# EAGLE design SenseLora 4G LTE CAT1 Gateway V1.2 (EAGLE 6.1)
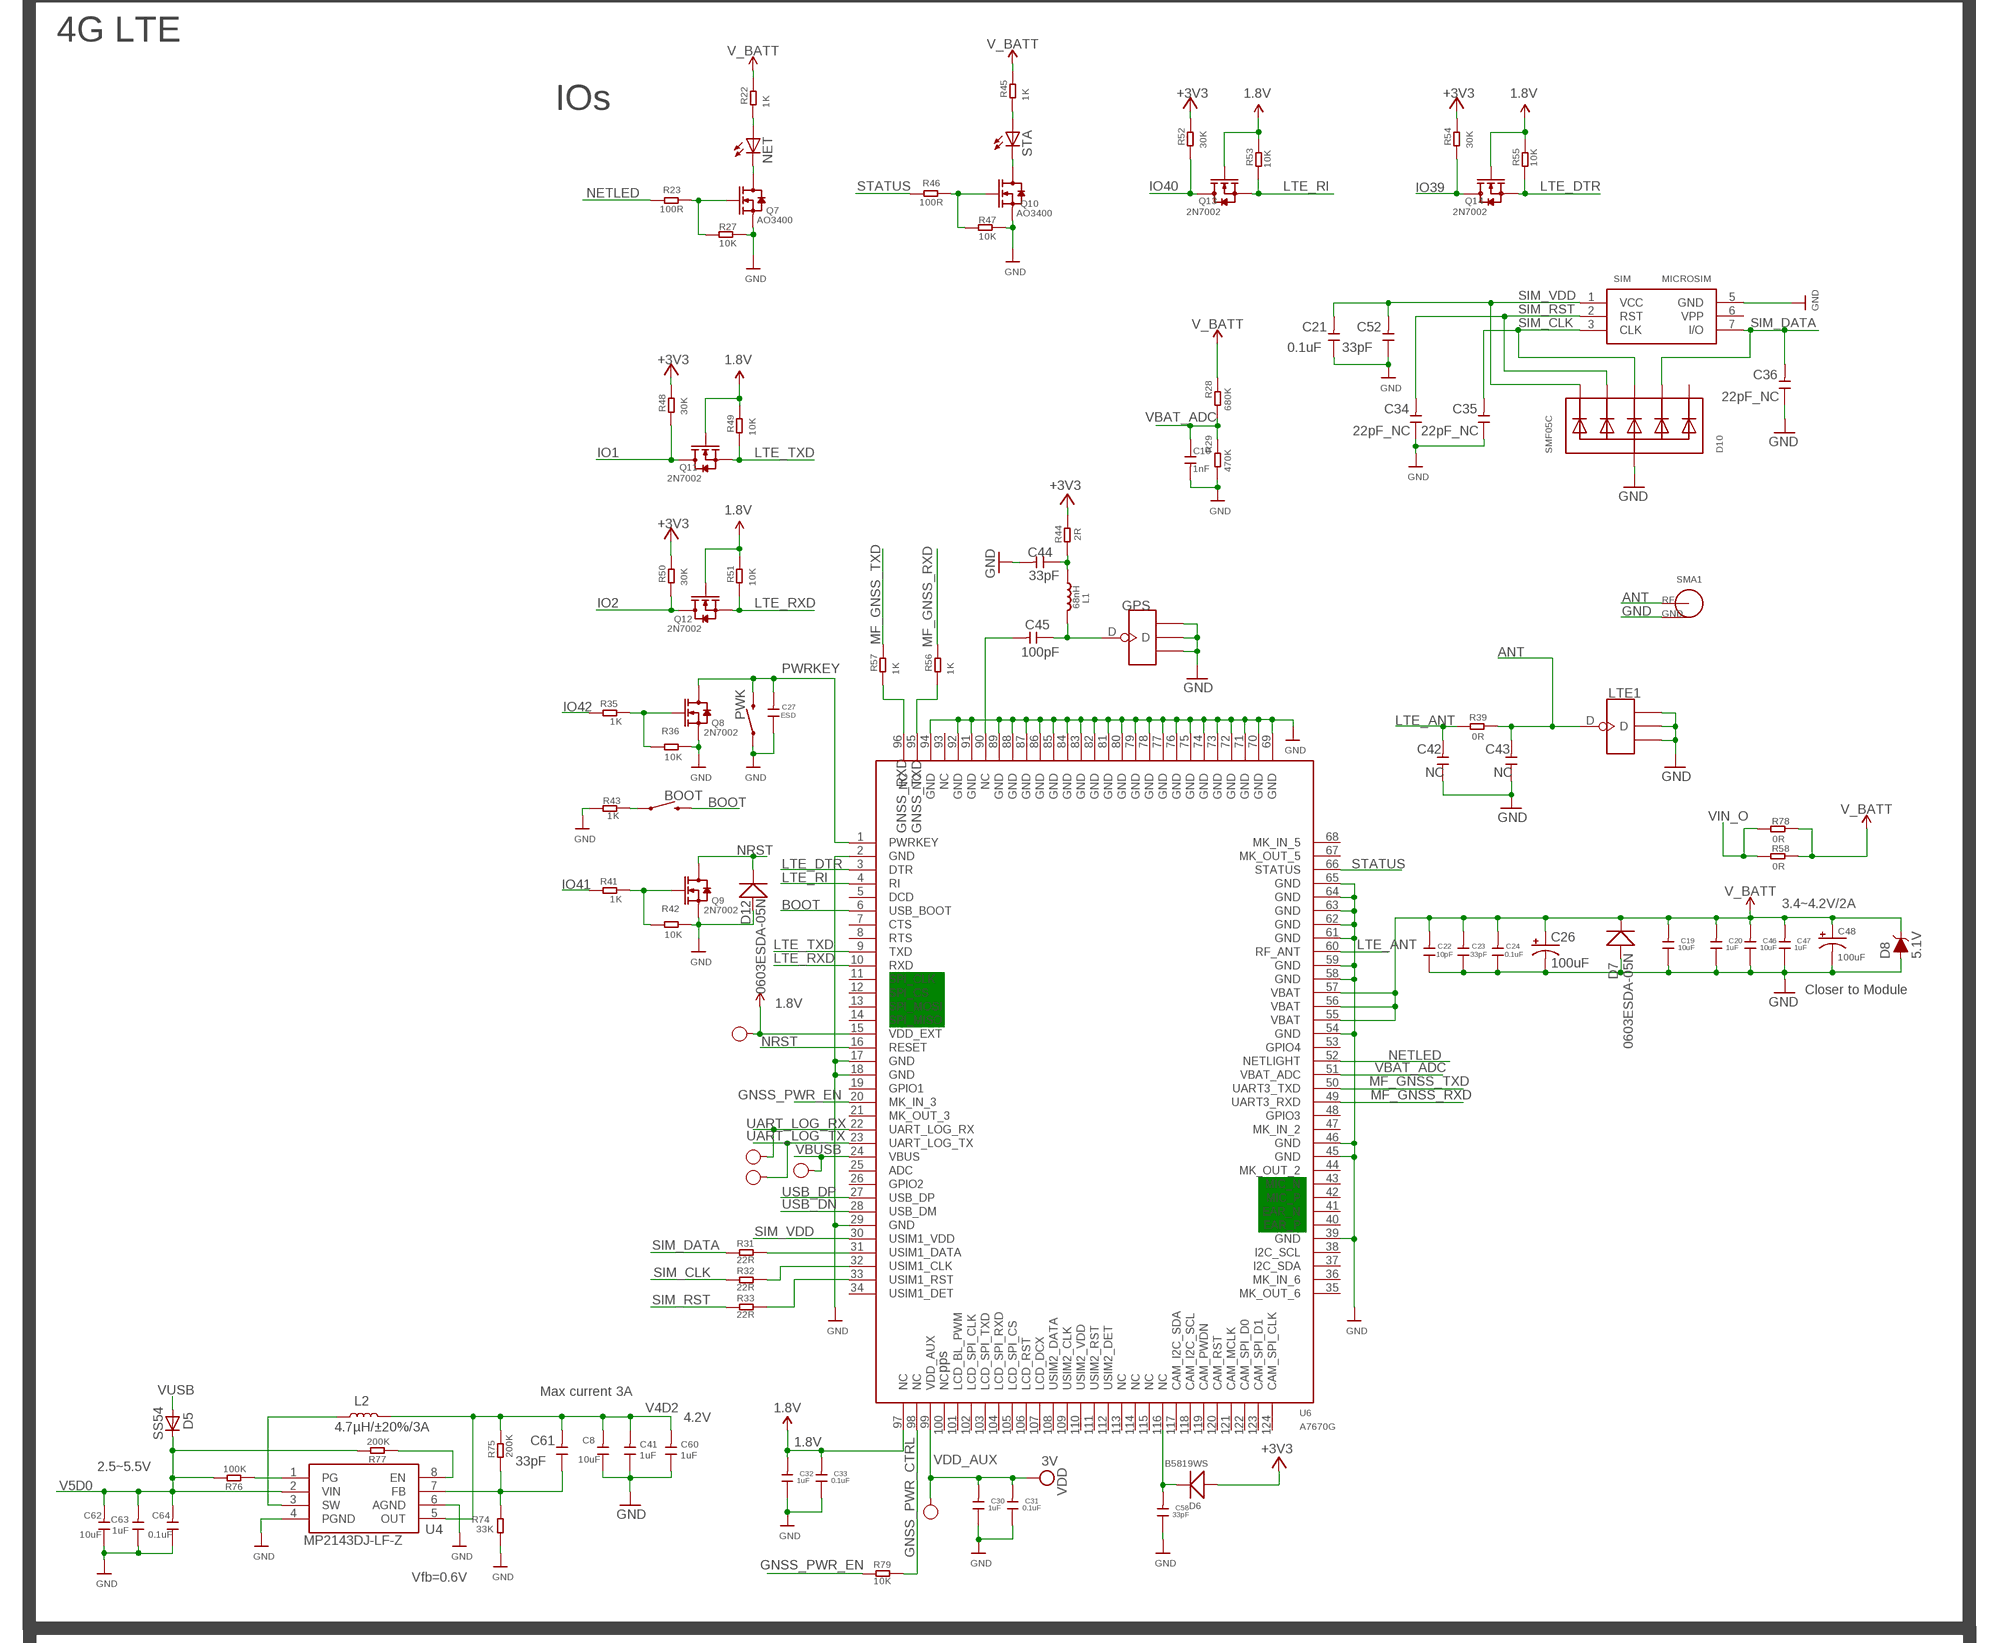
[diagram p0: schematic, sheet 1, part 1 of 2]
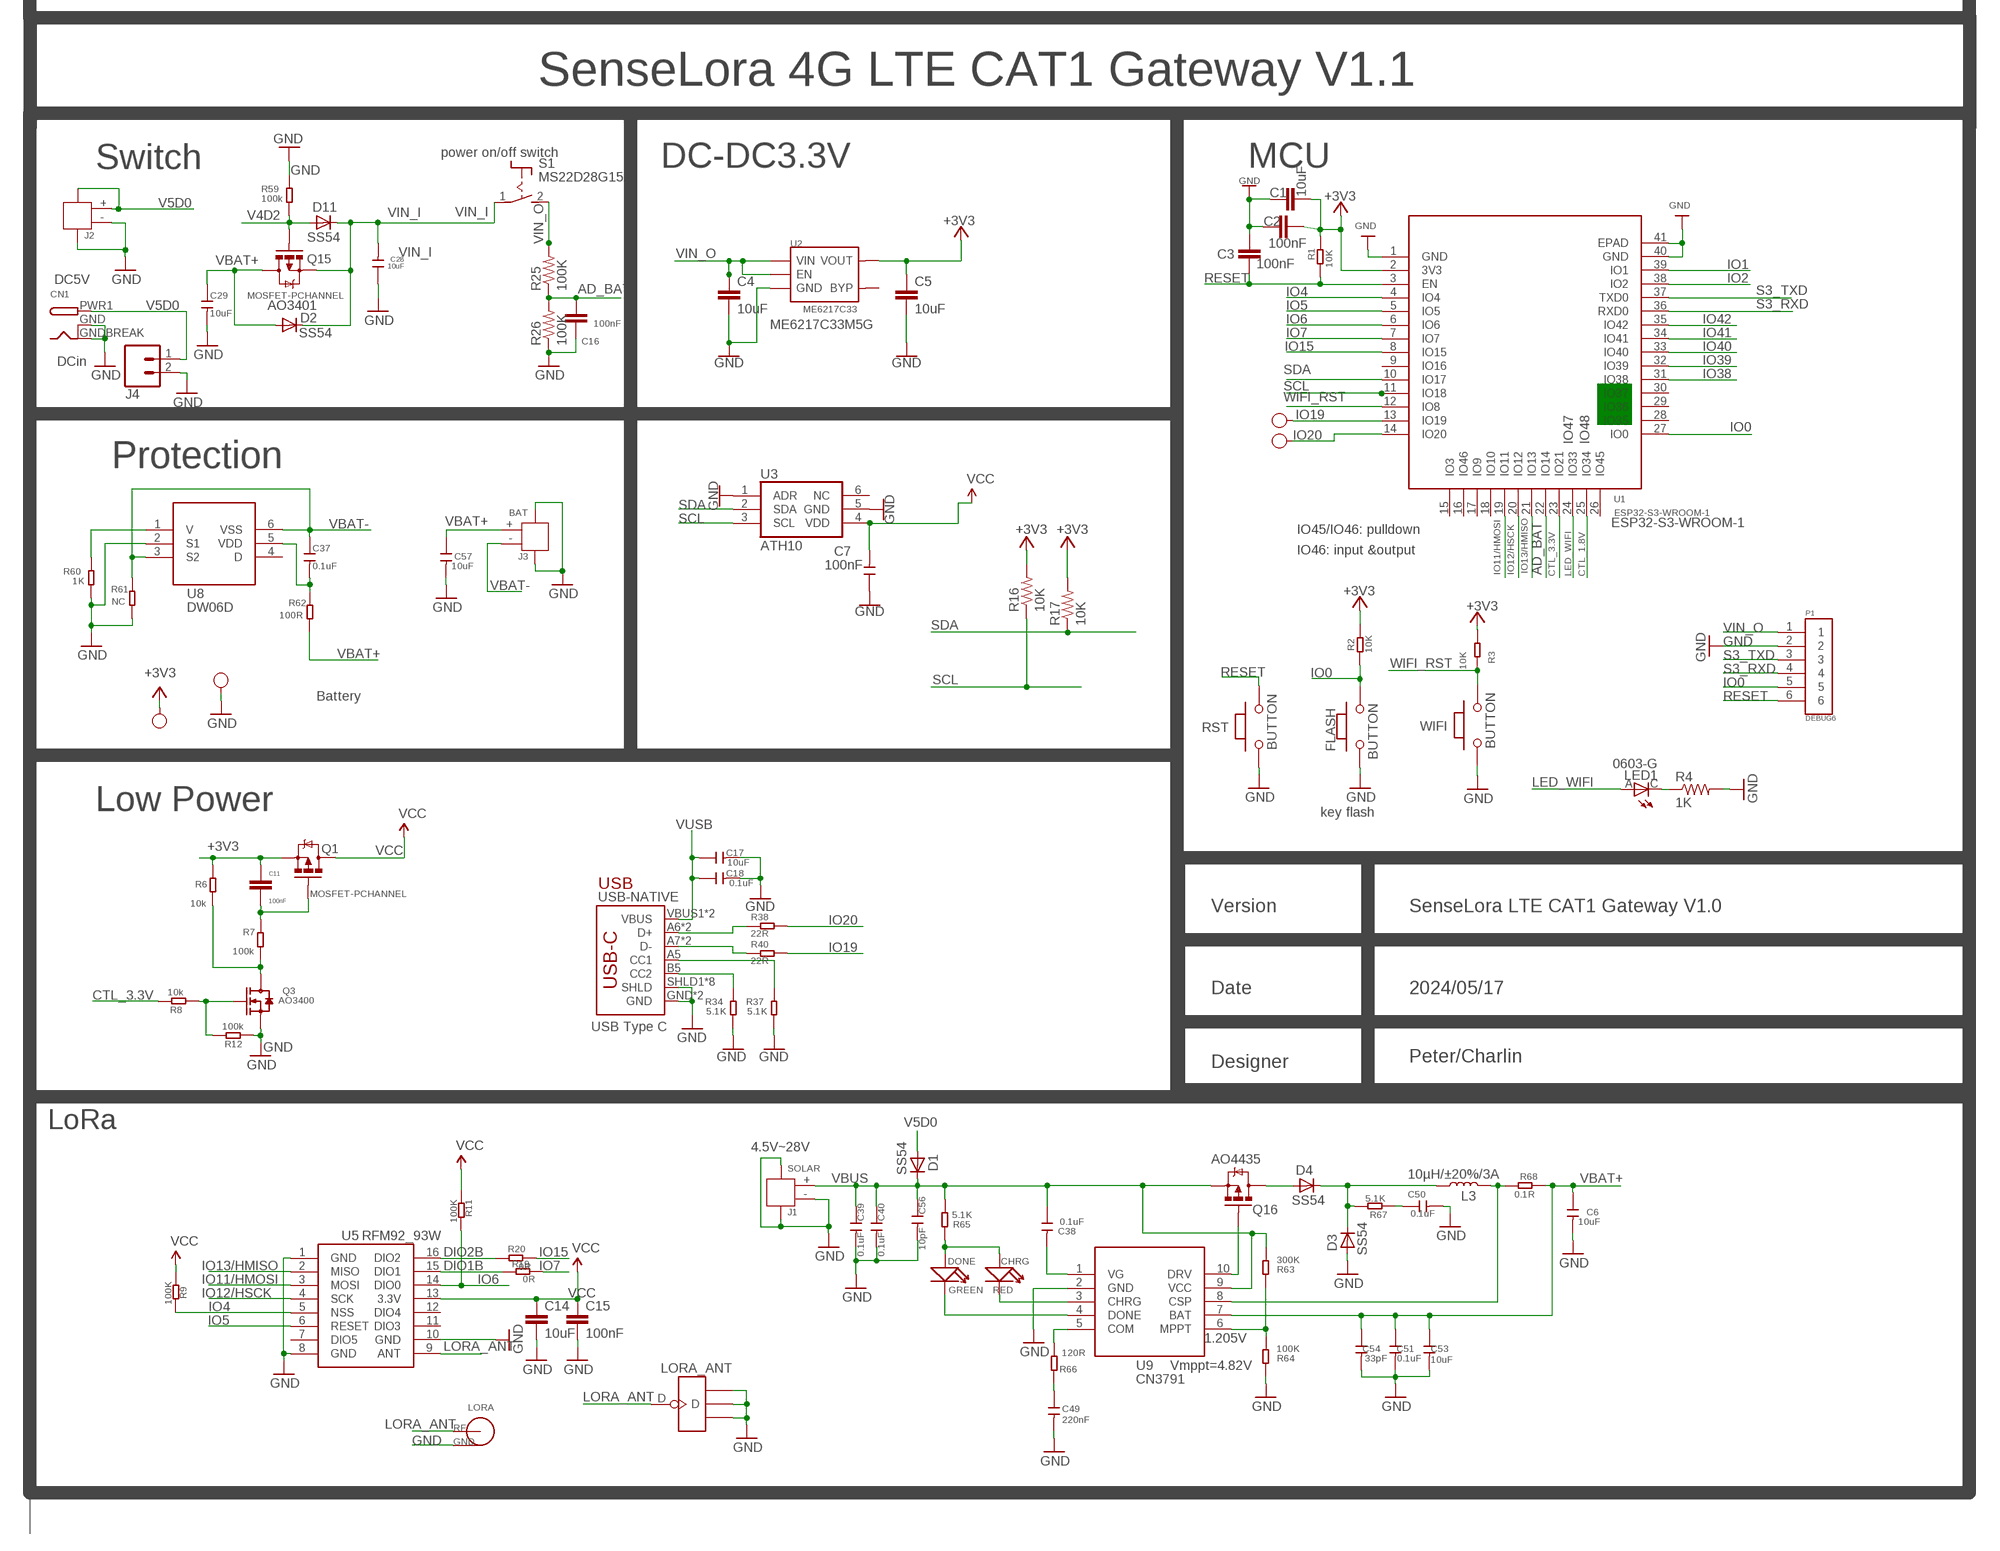
[diagram p1: schematic, sheet 1, part 2 of 2]

## Parts
1V8  TEST-POINT'4545'  [TP-D45MIL]
3V  TEST-POINT'4545'  [TP-D45MIL]
3V1  TEST-POINT'4545'  [TP-D45MIL]
3V2  TEST-POINT'4545'  [TP-D45MIL]
3V3  TEST-POINT'4545'  [TP-D45MIL]
BOOT  MOMENTARY-SWITCH-SPST-SMD-6.0X3.5MM  [TACTILE_SWITCH_SMD_6.0X3.5MM]
C1  10uF  C0603  [C0603]
C2  100nF  C0603  [C0603]
C3  100nF  C0603  [C0603]
C4  10uF  C0603  [C0603]
C5  10uF  C0603  [C0603]
C6  10uF  DISCRETE_C-0603  [DISCRETE_C0603]
C7  100nF  C-0603  [0603]
C8  10uF  C-0603  [0603]
C10  1nF  C-0603  [0603]
C11  100nF  C0603  [C0603]
C14  10uF  C0603  [C0603]
C15  100nF  C0603  [C0603]
C16  100nF  C0603  [C0603]
C17  10uF  C-0603  [0603]
C18  0.1uF  C-0603  [0603]
C19  10uF  C-0603  [0603]
C20  1uF  C-0603  [0603]
C21  0.1uF  C-0603  [0603]
C22  10pF  C-0603  [0603]
C23  33pF  C-0603  [0603]
C24  0.1uF  C-0603  [0603]
C26  100uF  68UF-POLAR-EIA3528-10V-10%(TANT)  [EIA3528]
C27  ESD  C-0603  [0603]
C28  10uF  C-0603  [0603]
C29  10uF  C-0603  [0603]
C30  1uF  C-0603  [0603]
C31  0.1uF  C-0603  [0603]
C32  1uF  C-0603  [0603]
C33  0.1uF  C-0603  [0603]
C34  22pF_NC  C-0603  [0603]
C35  22pF_NC  C-0603  [0603]
C36  22pF_NC  C-0603  [0603]
C37  0.1uF  C-0603  [0603]
C38  0.1uF  DISCRETE_C-0603  [DISCRETE_C0603]
C39  0.1uF  DISCRETE_C-0603  [DISCRETE_C0603]
C40  0.1uF  DISCRETE_C-0603  [DISCRETE_C0603]
C41  1uF  C-0603  [0603]
C42  NC  C-0603  [0603]
C43  NC  C-0603  [0603]
C44  33pF  C-0603  [0603]
C45  100pF  C-0603  [0603]
C46  10uF  C-0603  [0603]
C47  1uF  C-0603  [0603]
C48  100uF  68UF-POLAR-EIA3528-10V-10%(TANT)  [EIA3528]
C49  220nF  DISCRETE_C-0603  [DISCRETE_C0603]
C50  0.1uF  DISCRETE_C-0603  [DISCRETE_C0603]
C51  0.1uF  DISCRETE_C-0603  [DISCRETE_C0603]
C52  33pF  C-0603  [0603]
C53  10uF  DISCRETE_C-0603  [DISCRETE_C0603]
C54  33pF  DISCRETE_C-0603  [DISCRETE_C0603]
C56  10pF  DISCRETE_C-0603  [DISCRETE_C0603]
C57  10uF  DISCRETE_C-0603  [DISCRETE_C0603]
C58  33pF  C-0603  [0603]
C60  1uF  C-0603  [0603]
C61  33pF  C-0603  [0603]
C62  10uF  C-0603  [0603]
C63  1uF  C-0603  [0603]
C64  0.1uF  C-0603  [0603]
CHRG  RED  LED'0603'  [LED-0603]
CN1  DCBARRELSMT  [DCJACK_2MM_SMT]
D1  SS54  DIODE-DO-214AC  [DO-214AC]
D2  SS54  DIODE-DO-214AC  [DO-214AC]
D3  SS54  DIODE-DO-214AC  [DO-214AC]
D4  SS54  DIODE-DO-214AC  [DO-214AC]
D5  SS54  DIODE-DO-214AC  [DO-214AC]
D6  B5819WS  D'0805'  [SOD323]
D7  0603ESDA-05N  DISCRETE_D0603  [DISCRETE_SOD523]
D8  5.1V  DIODE-ZENER-MMSZ5232BS  [SOD-323]
D10  SMF05C  TVSARRAY_5LANE  [SOT363]
D11  SS54  DIODE-DO-214AC  [DO-214AC]
D12  0603ESDA-05N  DISCRETE_D0603  [DISCRETE_SOD523]
DONE  GREEN  LED'0603'  [LED-0603]
FLASH  BUTTON  PB157  [157SW]
GND  TEST-POINT'4545'  [TP-D45MIL]
GPS  ANTENNA-U-FL  [4P-U-FL]
J1  SOLAR  JST-2P-SMD'2.0'  [HW2-SMD-2.0-90D]
J2  DC  JST-2P-SMD'2.0'  [HW2-SMD-2.0-90D]
J3  BAT  JST-2P-SMD'2.0'  [HW2-SMD-2.0-90D]
J4  CONN_02PTH4  [1X02_XTRA_BIG]
L1  68nH  L'0603'  [L0603]
L2  4.7µH/±20%/3A  INDUCTOR-SRN6045-33UH  [SRN6045]
L3  10µH/±20%/3A  INDUCTOR-SRN6045-33UH  [SRN6045]
LED1  0603-G  LED0603  [LED0603]
LORA  SMA-KWE  [SMA-KWE]
LORA_ANT  ANTENNA-U-FL  [4P-U-FL]
LTE1  ANTENNA-U-FL  [4P-U-FL]
NET  NET  LEDCHIP-LED0805  [CHIP-LED0805]
P1  DEBUG6  [DEBUG*6]
PWK  MOMENTARY-SWITCH-SPST-SMD-6.0X3.5MM  [TACTILE_SWITCH_SMD_6.0X3.5MM]
Q1  MOSFET-PCHANNEL  [SOT23-3]
Q3  AO3400  MOSFET-N'SOT23'  [SOT23]
Q7  AO3400  MOSFET-N'SOT23'  [SOT23]
Q8  2N7002  MOSFET-N'SOT23'  [SOT23]
Q9  2N7002  MOSFET-N'SOT23'  [SOT23]
Q10  AO3400  MOSFET-N'SOT23'  [SOT23]
Q11  2N7002  MOSFET-N'SOT23'  [SOT23]
Q12  2N7002  MOSFET-N'SOT23'  [SOT23]
Q13  2N7002  MOSFET-N'SOT23'  [SOT23]
Q14  2N7002  MOSFET-N'SOT23'  [SOT23]
Q15  MOSFET-PCHANNEL  [SOT23-3]
Q16  MOSFET-PCHANNELFDS6675  [SO08]
R1  10K  R-0603  [R0603]
R2  10K  R-0603  [R0603]
R3  10K  R-0603  [R0603]
R4  1K  R0603  [R0603]
R6  10k  R-0603  [R0603]
R7  100k  R-0603  [R0603]
R8  10k  R-0603  [R0603]
R9  100K  R-0603  [R0603]
R11  100K  R-0603  [R0603]
R12  100k  R-0603  [R0603]
R16  10K  R0603  [R0603]
R17  10K  R0603  [R0603]
R19  0R  R-0603  [R0603]
R20  0R  R-0603  [R0603]
R22  1K  R-0603  [R0603]
R23  100R  R-0603  [R0603]
R25  100K  R0603  [R0603]
R26  100K  R0603  [R0603]
R27  10K  R-0603  [R0603]
R28  680K  R-0603  [R0603]
R29  470K  R-0603  [R0603]
R31  22R  R-0603  [R0603]
R32  22R  R-0603  [R0603]
R33  22R  R-0603  [R0603]
R34  5.1K  R-0603  [R0603]
R35  1K  R-0603  [R0603]
R36  10K  R-0603  [R0603]
R37  5.1K  R-0603  [R0603]
R38  22R  R-0603  [R0603]
R39  0R  R-0603  [R0603]
R40  22R  R-0603  [R0603]
R41  1K  R-0603  [R0603]
R42  10K  R-0603  [R0603]
R43  1K  R-0603  [R0603]
R44  2R  R-0603  [R0603]
R45  1K  R-0603  [R0603]
R46  100R  R-0603  [R0603]
R47  10K  R-0603  [R0603]
R48  30K  R-0603  [R0603]
R49  10K  R-0603  [R0603]
R50  30K  R-0603  [R0603]
R51  10K  R-0603  [R0603]
R52  30K  R-0603  [R0603]
R53  10K  R-0603  [R0603]
R54  30K  R-0603  [R0603]
R55  10K  R-0603  [R0603]
R56  1K  R-0603  [R0603]
R57  1K  R-0603  [R0603]
R58  0R  R-0603  [R0603]
R59  100k  R-0603  [R0603]
R60  1K  R-0603  [R0603]
R61  NC  R-0603  [R0603]
R62  100R  R-0603  [R0603]
R63  300K  DISCRETE_R-0603  [DISCRETE_R0603]
R64  100K  DISCRETE_R-0603  [DISCRETE_R0603]
R65  5.1K  DISCRETE_R-0603  [DISCRETE_R0603]
R66  120R  DISCRETE_R-0603  [DISCRETE_R0603]
R67  5.1K  DISCRETE_R-0603  [DISCRETE_R0603]
R68  0.1R  DISCRETE_R-2512  [DISCRETE_R2512]
R74  33K  R-0603  [R0603]
R75  200K  R-0603  [R0603]
R76  100K  R-0603  [R0603]
R77  200K  R-0603  [R0603]
R78  0R  R-0603  [R0603]
R79  10K  R-0603  [R0603]
RST  BUTTON  PB157  [157SW]
RX  TEST-POINT'4545'  [TP-D45MIL]
S1  MS22D28G15  [S-MS22D28G15]
SIM  MICROSIM  [MICROSIM]
SMA1  SMA-KWE  [SMA-KWE]
STA  NET  LEDCHIP-LED0805  [CHIP-LED0805]
TX  TEST-POINT'4545'  [TP-D45MIL]
U1  ESP32-S3-WROOM-1  ESP32­S2­SOLO  [ESP32-­S2-­SOLO]
U2  ME6217C33  SPX3819  [SOT23-5]
U3  ATH10  [AHT10]
U4  MP2143DJ-LF-Z  [TSOT23-8]
U5  RFM92_93W  [RFM92_93W]
U6  A7670G  [A7670G]
U8  DW06D  [SOT-23-6]
U9  CN3791  [SSOP-10-150MIL]
USB-NATIVE  USB_C5  [USB-C-16P-5]
VU  TEST-POINT'4545'  [TP-D45MIL]
WIFI  BUTTON  PB157  [157SW]

## Nets
1.8V: 1V8.T C32.2 C33.2 Q11.1(G) Q12.1(G) Q13.1(G) Q14.1(G) R49.2 R51.2 R53.2 R55.2 U6.15(VDD_EXT) U6.97(NC)
+3V3: 3V3.T C1.2 C2.2 C5.1 C11.1 D6.+ Q1.2(S) R1.2 R2.2 R3.2 R6.2 R16.2 R17.2 R44.2 R48.2 R50.2 R52.2 R54.2 U1.2(3V3) U2.5(VOUT)
AD_BAT: C16.2 R25.1 R26.2 U1.22(IO14)
ANT: C43.2 LTE1.D R39.2 SMA1.1(SIG)
BOOT: BOOT.2 U6.6(USB_BOOT)
CTL_1.8V: U1.25(IO34)
CTL_3.3V: R8.2 U1.23(IO21)
DIO1B: R19.2 U5.15(DIO1)
DIO2B: R20.2 U5.16(DIO2)
GND: C1.1 C2.1 C3.2 C4.2 C5.2 C6.2 C7.1 C8.1 C10.2 C14.2 C15.2 C16.1 C17.2 C18.2 C19.1 C20.1 C21.1 C22.1 C23.1 C24.1 C26.C(-) C27.1 C28.1 C29.2 C30.1 C31.1 C32.1 C33.1 C34.1 C35.1 C36.1 C39.2 C40.2 C41.1 C42.1 C43.1 C44.2 C46.1 C47.1 C48.C(-) C49.2 C50.2 C51.2 C52.1 C53.2 C54.2 C56.2 C57.2 C58.1 C60.1 C62.1 C63.1 C64.1 CN1.GND(GNDBREAK) CN1.GNDBREAK(GND) D3.A D7.+ D8.A D10.2(A) D12.+ FLASH.1 GND.T GPS.GND1 GPS.GND2 GPS.GND3 J1.3 J1.4 J1.- J2.3 J2.- J3.3 J3.4 J4.2 LORA.2(GND) LORA.3(GND) LORA.4(GND) LORA.5(GND) LORA_ANT.GND1 LORA_ANT.GND2 LORA_ANT.GND3 LTE1.GND1 LTE1.GND2 LTE1.GND3 P1.2 PWK.1 Q3.2(S) Q7.2(S) Q8.2(S) Q9.2(S) Q10.2(S) R4.2 R12.1 R26.1 R27.1 R29.1 R34.1 R36.1 R37.1 R42.1 R43.2 R47.1 R59.2 R60.1 R61.1 R64.1 R74.1 RST.1 SIM.5(GND) SMA1.2(GND) SMA1.3(GND) SMA1.4(GND) SMA1.5(GND) U1.1(GND) U1.40(GND) U1.41(EPAD) U2.2(GND) U3.1(ADR) U3.5(GND) U4.4(PGND) U4.6(AGND) U5.1(GND) U5.8(GND) U5.10(GND) U6.2(GND) U6.17(GND) U6.18(GND) U6.29(GND) U6.39(GND) U6.45(GND) U6.46(GND) U6.54(GND) U6.58(GND) U6.59(GND) U6.61(GND) U6.62(GND) U6.63(GND) U6.64(GND) U6.65(GND) U6.69(GND) U6.70(GND) U6.71(GND) U6.72(GND) U6.73(GND) U6.74(GND) U6.75(GND) U6.76(GND) U6.77(GND) U6.78(GND) U6.79(GND) U6.80(GND) U6.81(GND) U6.82(GND) U6.83(GND) U6.84(GND) U6.85(GND) U6.86(GND) U6.87(GND) U6.88(GND) U6.89(GND) U6.91(GND) U6.92(GND) U6.94(GND) U8.2(S1) U9.2(GND) USB-NATIVE.GND USB-NATIVE.GND2(GND) USB-NATIVE.SHLD1(SHLD) USB-NATIVE.SHLD2(SHLD) USB-NATIVE.SHLD3(SHLD) USB-NATIVE.SHLD4(SHLD) USB-NATIVE.SHLD5(SHLD) USB-NATIVE.SHLD6(SHLD) USB-NATIVE.SHLD7(SHLD) USB-NATIVE.SHLD8(SHLD) WIFI.1
GNSS_PWR_CTRL: R79.1 U6.98(NC)
GNSS_PWR_EN: R79.2 U6.20(MK_IN_3)
IO0: FLASH.2 P1.5 R2.1 U1.27(IO0)
IO1: Q11.3(D) R48.1 U1.39(IO1)
IO2: Q12.3(D) R50.1 U1.38(IO2)
IO4: R9.1 U1.4(IO4) U5.5(NSS)
IO5: U1.5(IO5) U5.6(RESET)
IO6: R11.1 U1.6(IO6) U5.14(DIO0)
IO7: R19.1 U1.7(IO7)
IO11/HMOSI: U1.19(IO11) U5.3(MOSI)
IO12/HSCK: U1.20(IO12) U5.4(SCK)
IO13/HMISO: U1.21(IO13) U5.2(MISO)
IO15: R20.1 U1.8(IO15)
IO19: 3V1.T R40.1 U1.13(IO19)
IO20: 3V2.T R38.1 U1.14(IO20)
IO38: U1.31(IO38)
IO39: Q14.3(D) R54.1 U1.32(IO39)
IO40: Q13.3(D) R52.1 U1.33(IO40)
IO41: R41.2 U1.34(IO41)
IO42: R35.2 U1.35(IO42)
LED_WIFI: LED1.A U1.24(IO33)
LORA_ANT: LORA.1(SIG) LORA_ANT.D U5.9(ANT)
LTE_ANT: C42.2 R39.1 U6.60(RF_ANT)
LTE_DTR: Q14.2(S) R55.1 U6.3(DTR)
LTE_RI: Q13.2(S) R53.1 U6.4(RI)
LTE_RXD: Q12.2(S) R51.1 U6.10(RXD)
LTE_TXD: Q11.2(S) R49.1 U6.9(TXD)
MF_GNSS_RXD: R56.2 U6.49(UART3_RXD)
MF_GNSS_TXD: R57.2 U6.50(UART3_TXD)
N$1: LED1.C R4.1
N$2: Q7.1(G) R23.1 R27.2
N$3: NET.C Q7.3(D)
N$6: NET.A R22.1
N$7: Q16.4(G) U9.10(DRV)
N$8: BOOT.1 R43.1
N$9: Q10.1(G) R46.1 R47.2
N$10: C37.2 R62.2 U8.5(VDD)
N$13: C11.2 Q1.1(G) R7.2
N$14: Q3.1(G) R8.1 R12.2
N$15: R60.2 U8.1(V)
N$16: R63.1 R64.2 U9.6(MPPT)
N$18: Q3.3(D) R6.1 R7.1
N$19: C58.2 D6.- U6.116(NC)
N$20: C38.2 U9.1(VG)
N$21: CHRG.+ DONE.+ R65.1
N$22: R31.1 U6.31(USIM1_DATA)
N$23: R32.1 U6.32(USIM1_CLK)
N$24: R33.1 U6.33(USIM1_RST)
N$25: CHRG.- U9.3(CHRG)
N$26: L2.1 U4.3(SW)
N$27: R37.2 USB-NATIVE.A5(CC1)
N$28: R34.2 USB-NATIVE.B5(CC2)
N$29: R45.1 STA.A
N$30: Q10.3(D) STA.C
N$32: R38.2 USB-NATIVE.A6(D+) USB-NATIVE.B6(D+)
N$33: R40.2 USB-NATIVE.A7(D-) USB-NATIVE.B7(D-)
N$34: Q9.1(G) R41.1 R42.2
N$35: C45.2 U6.90(NC)
N$36: DONE.- U9.4(DONE)
N$37: R56.1 U6.95(NC)
N$38: R57.1 U6.96(NC)
N$39: C61.1 R74.2 R75.1 U4.7(FB)
N$40: R76.1 U4.1(PG)
N$41: R66.2 U9.5(COM)
N$42: C49.1 R66.1
N$43: Q8.1(G) R35.1 R36.2
N$44: D4.A Q16.5(D) Q16.6(D) Q16.7(D) Q16.8(D)
N$45: D3.C D4.C L3.1 R67.2
N$46: L3.2 R68.1 U9.8(CSP)
N$47: C50.1 R67.1
N$50: R77.1 U4.8(EN)
N$73: C44.1 L1.1 R44.1
N$76: C45.1 GPS.D L1.2
NETLED: R23.2 U6.52(NETLIGHT)
NRST: D12.- Q9.3(D) U6.16(RESET)
PWRKEY: C27.2 PWK.2 Q8.3(D) U6.1(PWRKEY)
RESET: C3.1 P1.6 R1.1 RST.2 U1.3(EN)
S3_RXD: P1.4 U1.36(RXD0)
S3_TXD: P1.3 U1.37(TXD0)
SCL: R16.1 U1.11(IO18) U3.3(SCL)
SDA: R17.1 U1.10(IO17) U3.2(SDA)
SIM_CLK: C35.2 D10.4(C3) R32.2 SIM.3(CLK)
SIM_DATA: C36.2 D10.3(C2) R31.2 SIM.7(I/O)
SIM_RST: C34.2 D10.5(C4) R33.2 SIM.2(RST)
SIM_VDD: C21.2 C52.2 D10.6(C5) SIM.1(VCC) U6.30(USIM1_VDD)
STATUS: R46.2 U6.66(STATUS)
UART_LOG_RX: RX.T U6.22(UART_LOG_RX)
UART_LOG_TX: TX.T U6.23(UART_LOG_TX)
USB_DN: U6.28(USB_DM)
USB_DP: U6.27(USB_DP)
V4D2: C8.2 C41.2 C60.2 C61.2 D11.A L2.2 Q15.1(G) R59.1 R75.2 U4.5(OUT)
V5D0: C62.2 C63.2 C64.2 CN1.PWR1(PWR) D1.A D5.C J2.4 J2.+ J4.1 R76.2 R77.2 U4.2(VIN)
V_BATT: C19.2 C20.2 C22.2 C23.2 C24.2 C26.A(+) C46.2 C47.2 C48.A(+) D7.- D8.C R22.2 R28.2 R45.2 R58.1 R78.1 U6.55(VBAT) U6.56(VBAT) U6.57(VBAT)
VBAT+: C6.1 C29.1 C51.1 C53.1 C54.1 C57.1 D2.A J3.+ Q15.3(D) R62.1 R68.2 U9.7(BAT)
VBAT-: C37.1 J3.- R61.2 U8.3(S2) U8.6(VSS)
VBAT_ADC: C10.1 R28.1 R29.2 U6.51(VBAT_ADC)
VBUS: C38.1 C39.1 C40.1 C56.1 D1.C J1.+ Q16.1(S) Q16.2(S) Q16.3(S) R63.2 R65.2 U9.9(VCC)
VBUSB: U6.24(VBUS) VU.T
VCC: C7.2 C14.1 C15.1 Q1.3(D) R9.2 R11.2 U3.4(VDD) U5.13(3.3V)
VDD_AUX: 3V.T C30.2 C31.2 U6.99(VDD_AUX) ; supply symbol labelled VDD
VIN_I: C28.2 D2.C D11.C Q15.2(S) S1.1(P)
VIN_O: C4.1 P1.1 R25.2 R58.2 R78.2 S1.2(S) U2.1(VIN) U2.3(EN)
VUSB: C17.1 C18.1 D5.A USB-NATIVE.VBUS1(VBUS) USB-NATIVE.VBUS2(VBUS)
WIFI_RST: R3.1 U1.12(IO8) WIFI.2
Unconnected: D10.1(C1) SIM.6(VPP) U1.9(IO16) U1.15(IO3) U1.16(IO46) U1.17(IO9) U1.18(IO10) U1.26(IO45) U1.28(IO35) U1.29(IO36) U1.30(IO37) U2.4(BYP) U3.6(NC) U5.7(DIO5) U5.11(DIO3) U5.12(DIO4) U6.5(DCD) U6.7(CTS) U6.8(RTS) U6.11(SPI_CLK) U6.12(SPI_CS) U6.13(SPI_MOSI) U6.14(SPI_MISO) U6.19(GPIO1) U6.21(MK_OUT_3) U6.25(ADC) U6.26(GPIO2) U6.34(USIM1_DET) U6.35(MK_OUT_6) U6.36(MK_IN_6) U6.37(I2C_SDA) U6.38(I2C_SCL) U6.40(EAR_P) U6.41(EAR_N) U6.42(MIC_P) U6.43(MIC_N) U6.44(MK_OUT_2) U6.47(MK_IN_2) U6.48(GPIO3) U6.53(GPIO4) U6.67(MK_OUT_5) U6.68(MK_IN_5) U6.93(NC) U6.100(NC) U6.101(LCD_BL_PWM) U6.102(LCD_SPI_CLK) U6.103(LCD_SPI_TXD) U6.104(LCD_SPI_RXD) U6.105(LCD_SPI_CS) U6.106(LCD_RST) U6.107(LCD_DCX) U6.108(USIM2_DATA) U6.109(USIM2_CLK) U6.110(USIM2_VDD) U6.111(USIM2_RST) U6.112(USIM2_DET) U6.113(NC) U6.114(NC) U6.115(NC) U6.117(CAM_I2C_SDA) U6.118(CAM_I2C_SCL) U6.119(CAM_PWDN) U6.120(CAM_RST) U6.121(CAM_MCLK) U6.122(CAM_SPI_D0) U6.123(CAM_SPI_D1) U6.124(CAM_SPI_CLK) U8.4(D)

## Notes on the sheet
- 4G LTE
- IOs
- GNSS_RXD | GNSS_TXD
- 3.4~4.2V/2A
- Closer to Module
- pps
- Max current 3A
- 4.2V
- 3V
- 2.5~5.5V
- Vfb=0.6V
- SenseLora 4G LTE CAT1 Gateway V1.1
- power on/off switch
- Switch | DC-DC3.3V | MCU
- DC5V
- AO3401
- ME6217C33M5G
- DCin
- IO47 | IO48
- Protection
- ESP32-S3-WROOM-1
- IO45/IO46: pulldown
- IO46: input &output
- Battery
- Low Power
- key flash
- USB
- Version | SenseLora LTE CAT1 Gateway V1.0
- Date | 2024/05/17
- USB Type C
- Peter/Charlin
- Designer
- LoRa
- 4.5V~28V
- AO4435
- 1.205V
- Vmppt=4.82V

## Library data of the parts
1V8 3V 3V1-3V3 GND RX TX VU = Discrete-new:TEST-POINT; PARTNO: DNP
BOOT PWK = SparkFun-Switches:MOMENTARY-SWITCH-SPST: Momentary Switch (Pushbutton) - SPST Normally-open (NO) SPST momentary switches (buttons, pushbuttons). Variants PTH-12MM - 12mm square, through-hole Momentary Pushbutton Switch - 12mm Square <https://www.sparkfun.com/products/9190> (COM-09190) PTH-6.0MM, PTH-6.0MM-KIT - 6.0mm square, through-hole Mini Pushbutton Switch <https://www.sparkfun.com/products/97> (COM-00097) KIT package intended for soldering kit's - only one side of pads' copper is exposed. PTH-RIGHT-ANGLE-KIT - Right-angle, through-hole Right Angle Tactile Button <https://www.sparkfun.com/products/10791> - Used on SparkFun BigTime Watch Kit <https://www.sparkfun.com/products/11734> SMD-12MM - 12mm square, surface-mount Tactile Button - SMD (12mm) <https://www.sparkfun.com/products/12993> (COM-12993) Used on SparkFun PicoBoard <https://www.sparkfun.com/products/11888> SMD-4.5MM - 4.5mm Square Trackball Switch Used on SparkFun Blackberry Trackballer Breakout <https://www.sparkfun.com/products/13169> SMD-4.6MMX2.8MM - 4.60mm x 2.80mm, surface mount Used on SparkFun SAMD21 Mini Breakout <https://www.sparkfun.com/products/13664> SMD-5.2MM, SMD-5.2-REDUNDANT - 5.2mm square, surface-mount Mini Pushbutton Switch - SMD <https://www.sparkfun.com/products/8720> (COM-08720) Used on Arduino Pro Mini <https://www.sparkfun.com/products/11114> REDUNDANT package connects both switch circuits together SMD-6.0X3.5MM - 6.0 x 3.5mm, surface mount Momentary Reset Switch SMD <https://www.sparkfun.com/products/8229> (COM-08229) SMD-6.2MM-TALL - 6.2mm square, surface mount Tactile Button - SMD (6mm) <https://www.sparkfun.com/products/12992> Used on SparkFun Digital Sandbox <https://www.sparkfun.com/products/12651> SMD-RIGHT-ANGLE - Right-angle, surface mount Used on SparkFun Block for Intel® Edison - Arduino <https://www.sparkfun.com/products/13036>; PROD_ID: SWCH-00815; SF_SKU: COM-08229
C1-C5 C11 C14-C16 = Makerfabs-Peter:C0603
C6 C38-C40 C49-C51 C53 C54 C56 C57 = A9G:DISCRETE_C*: Ceramic Capacitors
C7 C8 C10 C17-C24 C27-C37 C41-C47 C52 C58 C60-C64 = Discrete:C*: Ceramic Capacitors
C26 C48 = SparkFun-Capacitors:68UF-POLAR: 68µF polarized capacitors A capacitor is a passive two-terminal electrical component used to store electrical energy temporarily in an electric field.; PROD_ID: CAP-10790; VALUE: 68uF
CHRG DONE = Discrete:LED*
CN1 = adafruit:DCBARREL: 2.0mm DC Barrel Jack DCJACK_2MM_PTH - Through Hole Jack (4UConnector: 05537)
D1-D5 D11 = diode:DIODE-: DIODE
D6 = Discrete:D*
D7 D12 = L:DISCRETE_D*
D8 = SparkFun-DiscreteSemi:DIODE-ZENER: Zener Diode A Zener diode allows current to flow from its anode to its cathode like a normal semiconductor diode, but it also permits current to flow in the reverse direction when its "Zener voltage" is reached. - WIkipedia; PROD_ID: DIO-12442; VALUE: 5.6V
D10 = microbuilder:TVSARRAY_5LANE: Voltage Transient Suppressor Array SOT363 SMF05C - 100W 5V: Digikey - SMF05CT1GOSCT-ND
FLASH RST WIFI = MySMD:PB157
GPS LORA_ANT LTE1 = Connector:ANTENNA-U-FL
J1-J3 = Connector-new:JST-2P-SMD: 2P-SMD-1.0-90D:320110054;2P-SMD-2.0-90D:320110026
J4 = SparkFun-Retired:CONN_02: Multi connection point. Often used as Generic Header-pin footprint for 0.1 inch spaced/style header connections On any of the 0.1 inch spaced packages, you can populate with these: Break Away Headers - Straight <https://www.sparkfun.com/products/116> (PRT-00116) Break Away Male Headers - Right Angle <https://www.sparkfun.com/products/553> (PRT-00553) Female Headers <https://www.sparkfun.com/products/115> (PRT-00115) Break Away Headers - Machine Pin <https://www.sparkfun.com/products/117> (PRT-00117) Break Away Female Headers - Swiss Machine Pin <https://www.sparkfun.com/products/743> (PRT-00743) For SCREWTERMINALS and SPRING TERMINALS visit here: Screw Terimnals on SparkFun.com <https://www.sparkfun.com/search/results?term=Screw+Terminals> (5mm/3.5mm/2.54mm spacing) This device is also useful as a general connection point to wire up your design to another part of your project. Our various solder wires solder well into these plated through hole pads. Hook-Up Wire - Assortment (Stranded, 22 AWG) <https://www.sparkfun.com/products/11375> (PRT-11375) Hook-Up Wire - Assortment (Solid Core, 22 AWG) <https://www.sparkfun.com/products/11367> (PRT-11367) View the entire wire category on our website here <https://www.sparkfun.com/categories/141> Special notes: Molex polarized connector foot print use with: PRT-08233 with associated crimp pins and housings. 2.54_SCREWTERM for use with PRT-10571. 3.5mm Screw Terminal footprints for PRT-08084 5mm Screw Terminal footprints for use with PRT-08432
L1 = Discrete:L*
L2 L3 = SparkFun-Coils:INDUCTOR: Inductors Resist changes in electrical current. Basically a coil of wire. SparkFun Products: SparkFun Load Cell Amplifier - HX711 <https://www.sparkfun.com/products/13879> IOIO-OTG - V2.2 <https://www.sparkfun.com/products/13613>; PROD_ID: NDUC-11627; VALUE: 33µH/±20%/1.4A
LED1 = Makerfabs-Peter:LED0603
LORA SMA1 = dragino:SMA-KWE
NET STA = adafruit2:LED: LED OSRAM: - CHIPLED LG R971, LG N971, LY N971, LG Q971, LY Q971, LO R971, LY R971 LH N974, LH R974 LS Q976, LO Q976, LY Q976 LO Q996 - Hyper CHIPLED LW Q18S LB Q993, LB Q99A, LB R99A - SideLED LS A670, LO A670, LY A670, LG A670, LP A670 LB A673, LV A673, LT A673, LW A673 LH A674 LY A675 LS A676, LA A676, LO A676, LY A676, LW A676 LS A679, LY A679, LG A679 - Hyper Micro SIDELED® LS Y876, LA Y876, LO Y876, LY Y876 LT Y87S - SmartLED LW L88C, LW L88S LB L89C, LB L89S, LG L890 LS L89K, LO L89K, LY L89K LS L896, LA L896, LO L896, LY L896 - TOPLED LS T670, LO T670, LY T670, LG T670, LP T670 LSG T670, LSP T670, LSY T670, LOP T670, LYG T670 LG T671, LOG T671, LSG T671 LB T673, LV T673, LT T673, LW T673 LH T674 LS T676, LA T676, LO T676, LY T676, LB T676, LH T676, LSB T676, LW T676 LB T67C, LV T67C, LT T67C, LS T67K, LO T67K, LY T67K, LW E67C LS E67B, LA E67B, LO E67B, LY E67B, LB E67C, LV E67C, LT E67C LW T67C LS T679, LY T679, LG T679 LS T770, LO T770, LY T770, LG T770, LP T770 LB T773, LV T773, LT T773, LW T773 LH T774 LS E675, LA E675, LY E675, LS T675 LS T776, LA T776, LO T776, LY T776, LB T776 LHGB T686 LT T68C, LB T68C - Hyper Mini TOPLED® LB M676 - Mini TOPLED Santana® LG M470 LS M47K, LO M47K, LY M47K Source: http://www.osram.convergy.de/
P1 = Makerfabs-Peter:DEBUG*6
Q1 Q15 = User-Submitted:MOSFET-PCHANNEL: Generic PMOSFET IRLML2244 - TRANS-11153 (SOT-23 -20V -4.3A) (1.Gate 2.Source 3.Drain) FQP27P06 - COM-10349 <http://www.sparkfun.com/products/10349> (TO-220 -60V -27A) (1.Gate 2.Source 3.Drain); PROD_ID: TRANS-08285
Q3 Q7-Q14 = Discrete:MOSFET-N: IRLL014: http://www.vishay.com/docs/91319/sihll014.pdf
Q16 = User-Submitted:MOSFET-PCHANNEL: Generic PMOSFET IRLML2244 - TRANS-11153 (SOT-23 -20V -4.3A) (1.Gate 2.Source 3.Drain) FQP27P06 - COM-10349 <http://www.sparkfun.com/products/10349> (TO-220 -60V -27A) (1.Gate 2.Source 3.Drain)
R1-R3 R6-R9 R11 R12 R19 R20 R22 R23 R27-R29 R31-R62 R74-R79 = Discrete:R*
R4 R16 R17 R25 R26 = Makerfabs-Peter:R0603
R63-R68 = A9G:DISCRETE_R*
S1 = Makerfabs-Peter:MS22D28G15
SIM = Connector:MICROSIM
U1 = self:ESP32­S2­SOLO
U2 = IC:SPX3819
U3 = Makerfabs-Peter:ATH10
U4 = sale:MP2143DJ-LF-Z
U5 = dragino:RFM92_93W
U6 = sale:A7670G
U8 = self:DW06D
U9 = sale:CN3791
USB-NATIVE = USBC:USB_C: USB Type C 16Pin Connector Super Speed pins not available on the 16-pin purely SMD connector so this part is best for USB 2.0 implementations. D1 and D2 are tied together enabling D+/- no matter which way the cable is plugged into the connector. The two channel configuration pins (CC1/2) are exposed. These are normally connected to ground via 5.1k resistors but can be reconfigured for high current/high power applications.

## Net classes
0 default: width 0.203 mm, drill 0.305 mm, clearance 0.152 mm

## Board
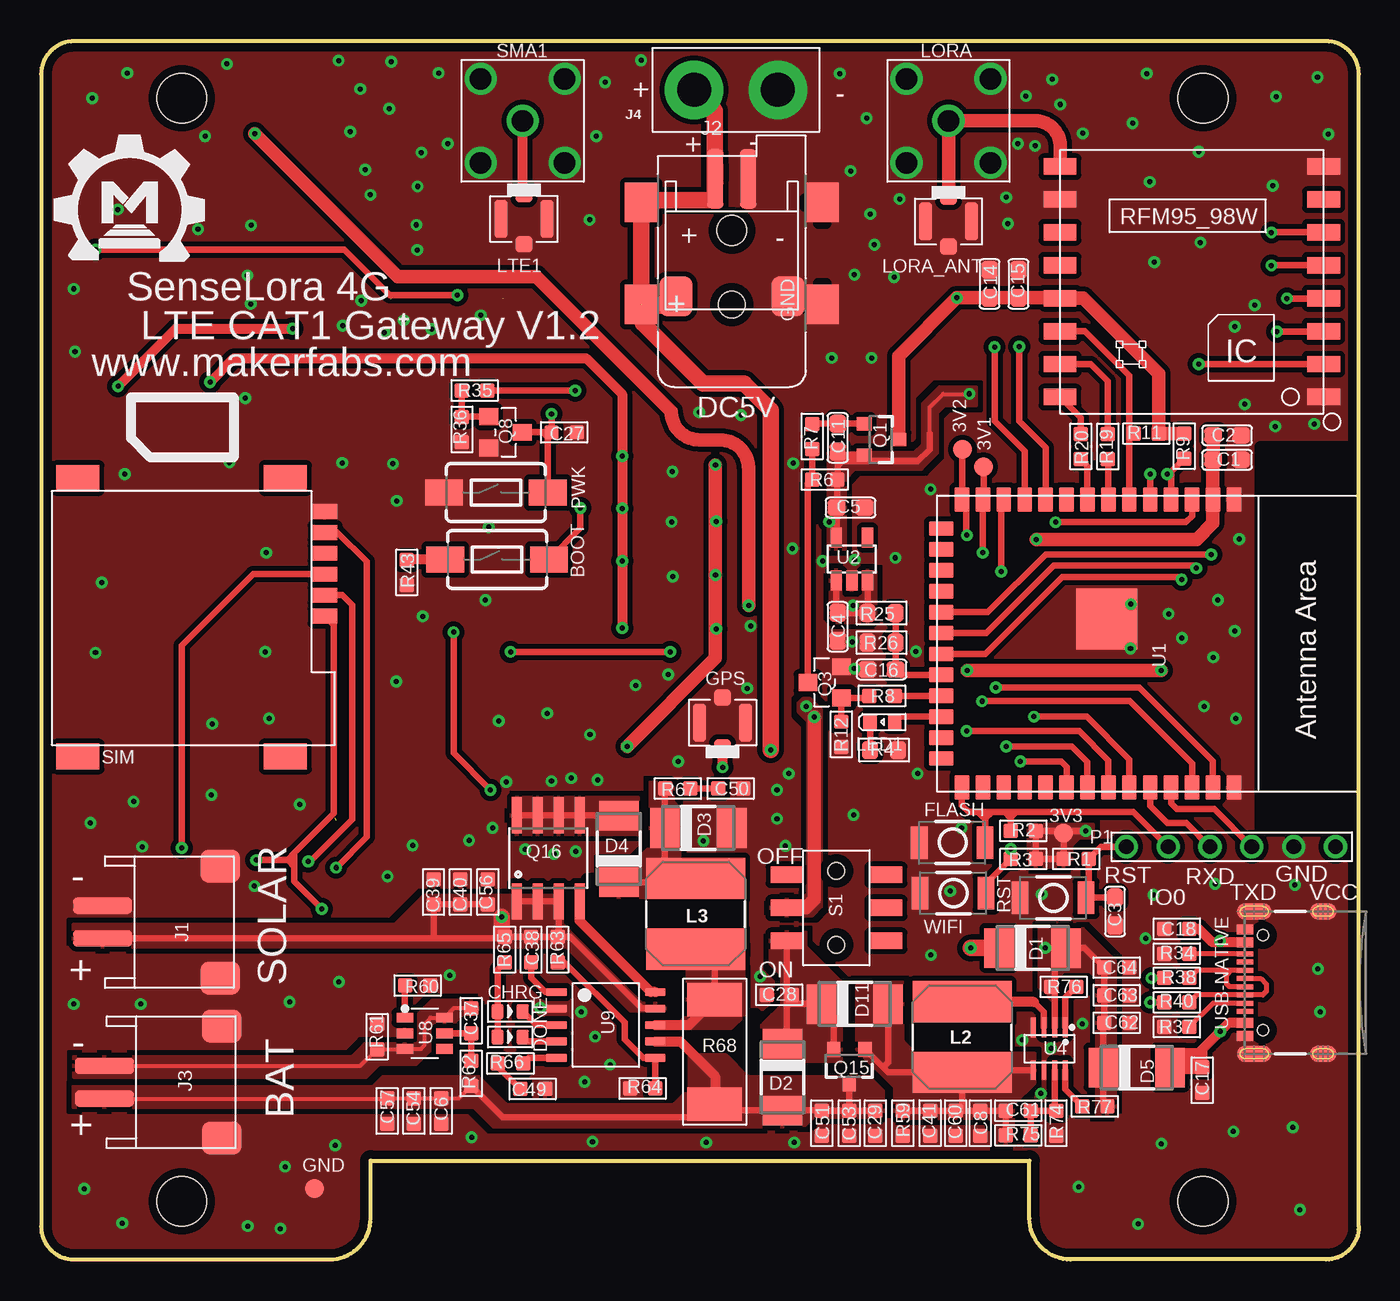
[diagram p2: board, top side]
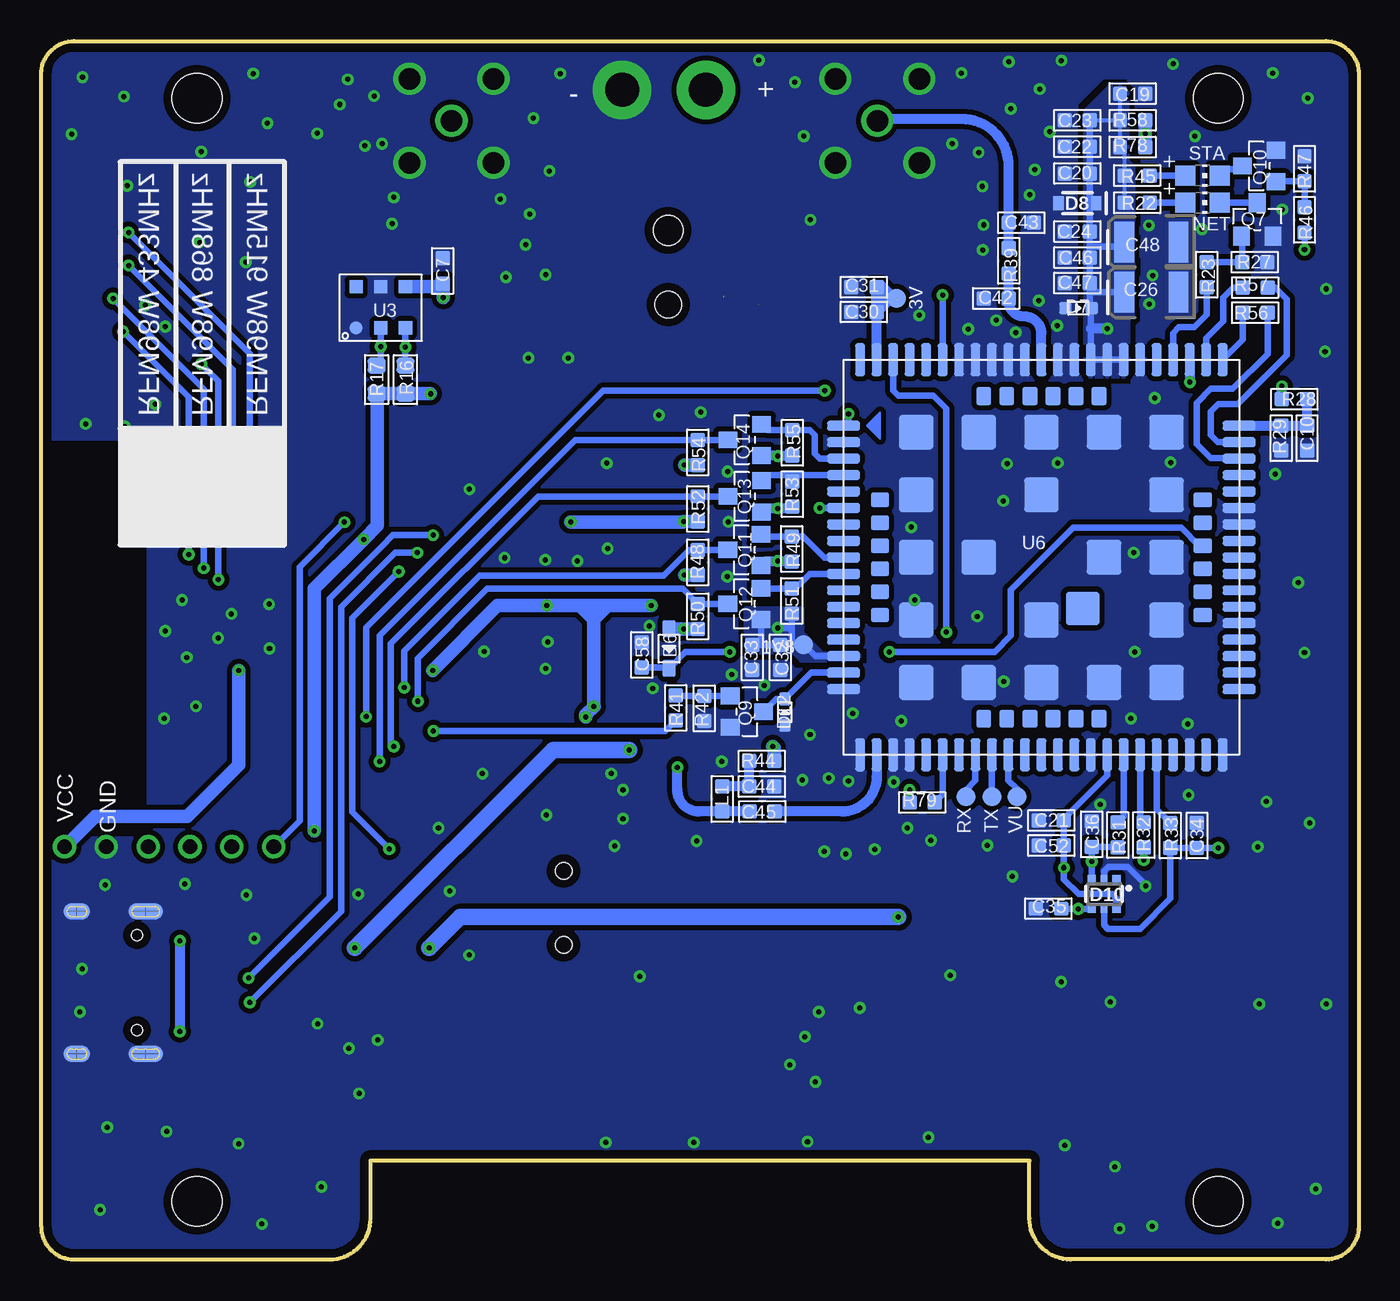
[diagram p3: board, bottom side, seen from below]

Size 80 x 74 mm. Coordinates in mm from the lower left corner, seen from the top.
Outline: 20,6 20,2.5 arc-90 17.5,0 2,0 arc-90 0,2 0,72 arc-90 2,74 78,74 arc-90 80,72 80,2 arc-90 78,0 62.5,0 arc-90 60,2.5 60,6 20.02,6
Copper layers (1*16): Top 0.035mm / dielectric 1.5mm / Bottom 0.035mm
Design rules: minimum track width 8mil, minimum drill 12mil, track to track 8mil, track to pad 8mil, pad to pad 8mil, via to via 8mil, smd to smd 0mil, copper to edge 20mil, drill to drill 8mil, minimum pad ring 10mil, minimum via ring 8mil, stop-mask expansion 0mil, vias tented up to drill 30mil, thermal gap 0mil
Holes 3 mm at 8.54,3.54 70.54,3.54 8.54,70.54 70.54,70.54
tRestrict: area 36.8,20.1 to 42.7,21.9; area 53.5,12.6 to 58.8,14.4; area 74,26 to 79.8,49.4; area 33.1,21.6 to 33.8,23.2; area 39.5,12.8 to 43.4,13.8; area 42.9,13.5 to 43.4,15
bRestrict: area 73.9,26 to 79.8,49.4

### Footprints (pad centres in the part's own frame; a part is rotated, then mirrored left to right if it is on the bottom)
TP-D45MIL = smd 1.143 x 1.143: T 0,0
TACTILE_SWITCH_SMD_6.0X3.5MM = smd 2.3 x 1.6: 1 -3.15,0; 2 3.15,0
C0603 = smd 1.1 x 1: 1 -0.85,0; 2 0.85,0
DISCRETE_C0603 = smd 0.889 x 0.889: 1 -0.762,0; 2 0.762,0
0603 = smd 0.889 x 0.889: 1 -0.762,0; 2 0.762,0
EIA3528 = smd 1.2 x 2.5: A 1.65,0; C -1.65,0
LED-0603 = smd 0.762 x 0.889: + -0.762,0; - 0.762,0
DCJACK_2MM_SMT = smd 2.4 x 2: GND 0,-5.5; GNDBREAK 6.2,-5.5; PWR1 0,5.5; PWR2 6.2,5.5 | hole 1.6: 0,0 | hole 1.8: 4.5,0
DO-214AC = smd 1.8 x 2.4: A 2.025,0; C -2.025,0
SOD323 = smd 1 x 0.8: + -1.2,0; - 1.2,0
DISCRETE_SOD523 = smd 0.762 x 0.7: + -0.8,0; - 0.8,0
SOD-323 = smd 0.63 x 0.83: A 1.15,0; C -1.15,0
SOT363 = smd 0.5 x 0.5: 1 -0.75,-0.9; 3 0.75,-0.9; 4 0.75,0.9; 6 -0.75,0.9 | smd 0.4 x 0.5: 2 0,-0.9; 5 0,0.9
157SW = smd 1.016 x 1.981: 1 0,0; 2 4,0
4P-U-FL = smd 1.016 x 1.016: D -1.524,0; GND3 1.524,0 | smd 2.286 x 0.762: GND1 0,1.397; GND2 0,-1.397
HW2-SMD-2.0-90D = smd 2 x 2.4: 3 3.4,-2.181; 4 -3.4,-2.181 | smd 1 x 3.6: + -1,4.953; - 1,4.953
1X02_XTRA_BIG = drill 2.057 pad 3.556: 1 -2.54,0; 2 2.54,0
L0603 = smd 0.889 x 0.889: 1 -0.762,0; 2 0.762,0
SRN6045 = smd 2.5 x 6: 1 -2.175,0; 2 2.125,0
LED0603 = smd 0.8 x 0.8: A -0.75,0; C 0.75,0
SMA-KWE = drill 1.3: 1 0,0; 2 -2.55,2.55; 3 2.55,2.55; 4 -2.55,-2.55; 5 2.55,-2.55
CHIP-LED0805 = smd 1.2 x 1.2: A 0,-1.05; C 0,1.05
DEBUG*6 = drill 0.9: 1 0,0; 2 0,2.54; 3 0,5.08; 4 0,7.62; 5 0,10.16; 6 0,12.7
SOT23-3 = smd 0.8 x 0.9: 1 -0.95,-1; 2 0.95,-1; 3 0,1.1
SOT23 = smd 1.016 x 1.143: 1 -0.95,-1.016; 2 0.95,-1.016; 3 0,1.016
SO08 = smd 0.61 x 2.21: 1 -1.905,-2.616; 2 -0.635,-2.616; 3 0.635,-2.616; 4 1.905,-2.616; 5 1.905,2.616; 6 0.635,2.616; 7 -0.635,2.616; 8 -1.905,2.616
R0603 = smd 0.889 x 0.889: 1 -0.762,0; 2 0.762,0
R0603' = smd 1 x 1.1: 1 -0.85,0; 2 0.85,0
DISCRETE_R0603 = smd 0.889 x 0.889: 1 -0.762,0; 2 0.762,0
DISCRETE_R2512 = smd 2.032 x 3.302: 1 -3.175,0; 2 3.175,0
S-MS22D28G15 = smd 1 x 2: 1 -2,3; 2 0,3; 3 2,3; 4 2,-3; 5 0,-3; 6 -2,-3 | hole 1: 2.25,0; -2.25,0
MICROSIM = smd 1.5 x 0.9: 1 -0.8,2.5; 2 -0.8,5.04; 3 -0.8,7.58; 5 -0.8,1.23; 6 -0.8,3.77; 7 -0.8,6.31 | smd 2.61 x 1.56: P$1 1.6,-0.8; P$2 14.2,-0.8; P$3 14.2,16.1; P$4 1.6,16.1
ESP32-­S2-­SOLO = smd 1.5 x 0.9: 1 -8.75,5.26; 2 -8.75,3.99; 3 -8.75,2.72; 4 -8.75,1.45; 5 -8.75,0.18; 6 -8.75,-1.09; 7 -8.75,-2.36; 8 -8.75,-3.63; 9 -8.75,-4.9; 10 -8.75,-6.17; 11 -8.75,-7.44; 12 -8.75,-8.71; 13 -8.75,-9.98; 14 -8.75,-11.25; 27 8.75,-11.25; 28 8.75,-9.98; 29 8.75,-8.71; 30 8.75,-7.44; 31 8.75,-6.17; 32 8.75,-4.9; 33 8.75,-3.63; 34 8.75,-2.36; 35 8.75,-1.09; 36 8.75,0.18; 37 8.75,1.45; 38 8.75,2.72; 39 8.75,3.99; 40 8.75,5.26 | smd 0.9 x 1.5: 15 -6.985,-12.5; 16 -5.715,-12.5; 17 -4.445,-12.5; 18 -3.175,-12.5; 19 -1.905,-12.5; 20 -0.635,-12.5; 21 0.635,-12.5; 22 1.905,-12.5; 23 3.175,-12.5; 24 4.445,-12.5; 25 5.715,-12.5; 26 6.985,-12.5 | smd 3.7 x 3.7: 41 -1.5,-2.46
SOT23-5 = smd 0.69 x 1.2: 1 -0.95,-1.3; 2 0,-1.3; 3 0.95,-1.3; 4 0.95,1.3; 5 -0.95,1.3
AHT10 = smd 0.8 x 0.8: 1 0.777,3.985; 2 0.777,2.485; 3 0.777,0.985; 4 3.277,0.985; 5 3.277,2.485; 6 3.277,3.985
TSOT23-8 = smd 1.2 x 0.3: 1 -1.3,0.975; 2 -1.3,0.325; 3 -1.3,-0.325; 4 -1.3,-0.975; 5 1.3,-0.975; 6 1.3,-0.325; 7 1.3,0.325; 8 1.3,0.975
RFM92_93W = smd 2 x 1: 1 -8,7; 2 -8,5; 3 -8,3; 4 -8,1; 5 -8,-1; 6 -8,-3; 7 -8,-5; 8 -8,-7; 9 8,-7; 10 8,-5; 11 8,-3; 12 8,-1; 13 8,1; 14 8,3; 15 8,5; 16 8,7
A7670G = smd 2 x 0.6: 1 -12,8; 2 -12,7; 3 -12,6; 4 -12,5; 5 -12,4; 6 -12,3; 7 -12,2; 8 -12,1; 9 -12,0; 10 -12,-1; 11 -12,-2; 12 -12,-3; 13 -12,-4; 14 -12,-5; 15 -12,-6; 16 -12,-7; 17 -12,-8; 35 12,-8; 36 12,-7; 37 12,-6; 38 12,-5; 39 12,-4; 40 12,-3; 41 12,-2; 42 12,-1; 43 12,0; 44 12,1; 45 12,2; 46 12,3; 47 12,4; 48 12,5; 49 12,6; 50 12,7; 51 12,8 | smd 0.6 x 2: 18 -8,-12; 19 -7,-12; 20 -6,-12; 21 -5,-12; 22 -4,-12; 23 -3,-12; 24 -2,-12; 25 -1,-12; 26 0,-12; 27 1,-12; 28 2,-12; 29 3,-12; 30 4,-12; 31 5,-12; 32 6,-12; 33 7,-12; 34 8,-12; 52 8,12; 53 7,12; 54 6,12; 55 5,12; 56 4,12; 57 3,12; 58 2,12; 59 1,12; 60 0,12; 61 -1,12; 62 -2,12; 63 -3,12; 64 -4,12; 65 -5,12; 66 -6,12; 67 -7,12; 68 -8,12; 89 -11,-12; 90 -10,-12; 91 -9,-12; 92 9,-12; 93 10,-12; 94 11,-12; 95 11,12; 96 10,12; 97 9,12; 98 -9,12; 99 -10,12; 100 -11,12 | smd 2.1 x 2.1: 69 -7.6,7.6; 70 -7.6,3.8; 71 -7.6,0; 72 -7.6,-3.8; 73 -7.6,-7.6; 74 -3.8,-7.6; 75 0,-7.6; 76 3.8,-7.6; 77 7.6,-7.6; 78 7.6,-3.8; 79 7.6,0; 80 7.6,3.8; 81 7.6,7.6; 82 3.8,7.6; 83 0,7.6; 84 -3.8,7.6; 85 -3.8,0; 86 0,-3.8; 87 3.8,0; 88 0,3.8 | smd 1.1 x 0.9: 101 -9.8,3.5; 102 -9.8,2.1; 103 -9.8,0.7; 104 -9.8,-0.7; 105 -9.8,-2.1; 106 -9.8,-3.5; 113 9.8,-3.5; 114 9.8,-2.1; 115 9.8,-0.7; 116 9.8,0.7; 117 9.8,2.1; 118 9.8,3.5 | smd 0.9 x 1.1: 107 -3.5,-9.8; 108 -2.1,-9.8; 109 -0.7,-9.8; 110 0.7,-9.8; 111 2.1,-9.8; 112 3.5,-9.8; 119 3.5,9.8; 120 2.1,9.8; 121 0.7,9.8; 122 -0.7,9.8; 123 -2.1,9.8; 124 -3.5,9.8 | smd 2.05 x 2.05: 125 2.5,-3.1
SOT-23-6 = smd 1 x 0.6: 1 -1.2,0.95; 2 -1.2,0; 3 -1.2,-0.95; 4 1.2,-0.95; 5 1.2,0; 6 1.2,0.95
SSOP-10-150MIL = smd 1.27 x 0.5: 1 -3,2; 2 -3,1; 3 -3,0; 4 -3,-1; 5 -3,-2; 6 3,-2; 7 3,-1; 8 3,0; 9 3,1; 10 3,2
USB-C-16P-5 = smd 0.3 x 1: A5 -1.25,-0.34; A6 -0.25,-0.34; A7 0.25,-0.34; A8 1.25,-0.34; B5 1.75,-0.34; B6 0.75,-0.34; B7 -0.75,-0.34; B8 -1.75,-0.34 | smd 0.6 x 1: GND -3.225,-0.34; GND2 3.225,-0.34; VBUS1 -2.45,-0.34; VBUS2 2.45,-0.34 | smd 1 x 2.1: SHLD1 -4.32,-0.915; SHLD2 4.32,-0.915 | smd 1 x 2.1 bottom: SHLD3 -4.32,-0.915; SHLD4 4.32,-0.915 | smd 1 x 1.6: SHLD5 -4.32,-5.095; SHLD8 4.32,-5.095 | smd 1 x 1.6 bottom: SHLD6 -4.32,-5.095; SHLD7 4.32,-5.095 | hole 0.65: -2.89,-1.445; 2.89,-1.445

### Placement (x,y rotation side)
1V8  33.7,37.34 180 bottom
3V  28.06,58.37 90 bottom
3V1  57.22,48.16 270 top
3V2  55.93,49.2 270 top
3V3  62.07,25.91 270 top
BOOT  27.68,42.52 0 top
C1  72.01,48.56 180 top
C2  72.01,50.06 180 top
C3  65.2,21.13 270 top
C4  48.36,38.43 270 top
C5  49.15,45.67 0 top
C6  24.28,9.02 270 top
C7  55.62,60.05 270 bottom
C8  57.02,8.28 90 top
C10  3.15,49.89 270 bottom
C11  48.36,49.91 90 top
C14  57.58,59.26 90 top
C15  59.33,59.26 90 top
C16  51.02,35.84 0 top
C17  70.48,10.9 270 top
C18  68.96,20.09 180 top
C19  13.74,70.82 180 bottom
C20  17.09,65.96 0 bottom
C21  18.67,26.67 0 bottom
C22  17.09,67.59 0 bottom
C23  17.09,69.19 0 bottom
C24  17.09,62.43 0 bottom
C26  12.59,58.75 180 bottom
C27  31.75,50.24 180 top
C28  44.8,16.08 0 top
C29  50.64,8.28 270 top
C30  30.04,57.56 0 bottom
C31  30.04,59.05 0 bottom
C32  35.12,36.58 90 bottom
C33  36.83,36.58 90 bottom
C34  9.83,25.76 270 bottom
C35  18.84,21.31 0 bottom
C36  16.23,25.83 270 bottom
C37  26.11,14.5 270 top
C38  29.74,18.82 270 top
C39  23.82,22.33 90 top
C40  25.45,22.33 90 top
C41  53.97,8.28 90 top
C42  22.02,58.37 0 bottom
C43  20.49,62.97 180 bottom
C44  36.24,28.73 0 bottom
C45  36.22,27.2 0 bottom
C46  17.09,60.86 0 bottom
C47  17.09,59.31 0 bottom
C48  12.59,61.8 180 bottom
C49  29.84,10.36 0 top
C50  41.86,28.6 0 top
C51  47.39,8.28 270 top
C52  18.67,25.15 0 bottom
C53  49.07,8.28 270 top
C54  22.63,9.02 270 top
C56  27.12,22.33 90 top
C57  21,9.02 270 top
C58  43.53,36.73 270 bottom
C60  55.52,8.28 90 top
C61  59.33,9.04 180 top
C62  65.3,14.38 180 top
C63  65.3,16.05 180 top
C64  65.3,17.73 180 top
CHRG  28.47,15.06 0 top
CN1  41.93,58 90 top
D1  60.19,18.92 0 top
D2  45.01,11.07 270 top
D3  39.9,26.21 0 top
D4  35.07,24.94 90 top
D5  66.52,11.66 0 top
D6  41.88,37.11 270 bottom
D7  17.01,57.78 0 bottom
D8  17.09,64.16 180 bottom
D10  15.46,22.2 180 bottom
D11  49.4,15.52 0 top
D12  34.84,33.25 90 bottom
DONE  28.47,13.51 0 top
FLASH  53.31,25.32 0 top
GND  16.58,4.32 0 top
GPS  41.37,32.61 90 top
J1  8.68,20.5 90 top
J2  41.93,60.68 0 top
J3  8.78,10.77 90 top
J4  42.19,71.04 0 top
L1  38.66,27.97 270 bottom
L2  55.93,13.49 270 top
L3  39.75,20.98 270 top
LED1  51.08,32.64 180 top
LORA  55.09,69.16 0 top
LORA_ANT  55.09,63.04 270 top
LTE1  29.31,63.2 270 top
NET  9.5,64.19 270 bottom
P1  78.58,25.07 90 top
PWK  27.61,46.58 0 top
Q1  50.97,49.81 270 top
Q3  47.57,35.05 90 top
Q7  6.17,63.17 0 bottom
Q8  28.19,50.24 270 top
Q9  37.16,33.27 270 bottom
Q10  6.04,66.42 90 bottom
Q11  37.31,43.1 90 bottom
Q12  37.31,39.83 90 bottom
Q13  37.28,46.35 90 bottom
Q14  37.28,49.78 90 bottom
Q15  49.07,11.76 180 top
Q16  30.78,24.37 0 top
R1  62.84,24.33 180 top
R2  59.64,26.04 0 top
R3  59.64,24.33 0 top
R4  1K  [R0603']  51.18,30.94 0 top
R6  47.57,47.37 0 top
R7  46.81,49.99 90 top
R8  51.05,34.24 0 top
R9  69.39,49.4 90 top
R11  67.1,50.16 0 top
R12  48.59,31.9 90 top
R16  10K  [R0603']  57.88,53.44 270 bottom
R17  10K  [R0603']  59.64,53.44 270 bottom
R19  64.77,49.38 90 top
R20  63.12,49.38 90 top
R22  13.46,64.19 180 bottom
R23  9.24,59.82 270 bottom
R25  100K  [R0603']  51.02,39.27 180 top
R26  100K  [R0603']  51.02,37.47 0 top
R27  6.32,60.58 180 bottom
R28  3.91,52.25 180 bottom
R29  4.72,49.89 90 bottom
R31  14.63,25.78 270 bottom
R32  13.05,25.78 270 bottom
R33  11.45,25.76 270 bottom
R34  68.96,18.57 0 top
R35  26.31,52.78 0 top
R36  25.55,50.42 90 top
R37  68.96,14.12 0 top
R38  68.96,17.09 0 top
R39  21.26,60.66 90 bottom
R40  68.96,15.62 0 top
R41  41.47,33.5 270 bottom
R42  39.75,33.48 90 bottom
R43  22.2,41.73 270 top
R44  36.24,30.28 0 bottom
R45  13.46,65.84 180 bottom
R46  3.3,63.14 270 bottom
R47  3.3,66.24 270 bottom
R48  40.13,42.34 270 bottom
R49  34.44,43.15 270 bottom
R50  40.13,39.07 270 bottom
R51  34.44,40.01 270 bottom
R52  40.13,45.59 270 bottom
R53  34.39,46.48 270 bottom
R54  40.13,49.02 270 bottom
R55  34.39,49.61 270 bottom
R56  6.3,57.51 0 bottom
R57  6.3,59.03 0 bottom
R58  13.74,69.19 0 bottom
R59  52.32,8.28 270 top
R60  22.86,16.64 180 top
R61  20.39,13.54 270 top
R62  26.11,11.3 90 top
R63  31.37,18.82 90 top
R64  36.52,10.39 0 top
R65  28.14,18.82 90 top
R66  28.5,11.91 0 top
R67  38.66,28.6 180 top
R68  40.89,12.62 270 top
R74  61.62,8.28 90 top
R75  59.33,7.54 180 top
R76  62.07,16.56 180 top
R77  63.98,9.3 0 top
R78  13.74,67.56 0 bottom
R79  26.51,27.76 0 bottom
RST  59.43,21.97 0 top
RX  23.85,28.12 0 bottom
S1  48.28,21.36 90 top
SIM  16.43,46.66 180 top
SMA1  29.23,69.16 0 top
STA  9.5,65.84 270 bottom
TX  22.27,28.12 0 bottom
U1  67.15,37.41 270 top
U2  49.22,42.55 0 top
U3  56.89,55.8 90 bottom
U4  61.21,12.8 270 top
U5  69.86,59.39 180 top
U6  19.27,42.65 0 bottom
U8  23.29,13.74 0 top
U9  34.29,14.25 0 top
U$2  [MAKERFABS_0.3]  1.25,60.69 0 top
USB-NATIVE  72.74,16.81 90 top
VU  20.75,28.12 180 bottom
WIFI  53.36,22.25 0 top

### Tracks (layer width: path | path; a pad name or v marks a point on that pad's centre or on a via)
1.8V  (via drill 0.3)
  Top 0.61: v35.28,38.35 v35.28,42.42 v35.28,45.62 v35.28,48.79 35.28,52.55 33.09,54.74 11.71,54.74 v10.26,53.29
  Bottom 0.406: 35.95,45.72 Q13.1 | U6.15 33.01,36.65 1V8.T 34.44,37.34 | 34.44,37.34 C32.2 36.24,37.34 | 36.24,37.34 C33.2 | R51.2 34.44,38.35 | 34.44,38.35 34.44,37.34 | Q12.1 36.29,37.39 36.24,37.34 | 35.23,48.84 v35.28,48.79 | v35.28,38.35 34.44,38.35 | 35.3,42.39 v35.28,42.42 | 10.28,53.31 v10.26,53.29
  Bottom 0.61: U6.97 10.28,53.31 | Q14.1 36.26,48.84 35.23,48.84 R55.2 | R53.2 34.49,45.62 v35.28,45.62 36.05,45.62 Q13.1 | R49.2 35.25,42.39 v35.28,42.42 | 35.3,42.39 36.05,42.39 Q11.1
  pour Bottom: 30.32,36.35 33.83,36.35 34.31,36.83 37.21,36.83 37.21,39.57 33.8,39.57 33.8,38.07 32.61,36.88 32.56,36.83 30.32,36.83
+3V3  (via drill 0.3)
  Top 0.254: 53.95,50.16 53.95,51.77 54.76,52.58 v56.36,52.58
  Top 0.406: 3V3.T R1.2 R3.2 R2.2 v63.42,26.04 | 71.14,48.55 C1.2 | 48.36,48.18 C11.1 48.56,48.86 Q1.2 | 48.36,48.18 48.36,47.4 R6.2 48.33,45.71 C5.1 48.3,44.81 | 48.3,44.81 48.3,43.87 U2.5 | 40.94,36.52 40.94,38.25 v40.99,38.3 | v40.99,44.83 40.99,44.22 40.94,44.17 | v47.85,44.81 48.3,44.81 | 53.95,50.16 53.95,49.2 53.23,48.49 48.66,48.49 48.36,48.18
  Top 0.813: 71.14,48.55 U1.2 71.14,44.73 70.15,43.74 v60.42,43.74 | C1.2 C2.2 | v40.94,48.26 40.94,44.17 v40.94,41.58 40.94,36.52 v35.58,31.17
  Bottom 0.406: 56.37,52.59 v56.36,52.58
  Bottom 0.813: 56.37,52.59 R16.2 R17.2 59.59,52.54 59.59,44.58 v60.42,43.74 63.42,40.74 v63.42,26.04 | R44.2 35.48,31.06 v35.58,31.17 | R54.2 v40.94,48.26 | R52.2 v40.99,44.83 41.02,44.81 v47.85,44.81 | R50.2 v40.99,38.3 D6.+ | R48.2 v40.94,41.58
  pour Top: 59.97,26.42 63.85,26.42 63.85,25.6 62.99,25.6 62.53,25.15 62.53,23.85 59.97,23.85
  pour Top: 48.81,43.18 48.81,47.45 49.4,48.03 53.44,48.03 54.4,49 54.4,51.44 54.86,51.89 56.77,51.89 56.77,52.96 54.53,52.96 53.51,51.94 53.51,49.48 53.01,48.97 47.77,48.97 47.77,43.23 47.77,43.18
AD_BAT
  Top 0.406: R25.1 R26.2 C16.2 52.2,35.51 U1.22
ANT
  Top 0.61: LTE1.D 29.23,64.8 29.23,69.06 SMA1.1
  Bottom 0.61: SMA1.1 29.23,68.63 | R39.2 C43.2 21.26,66.42 arc-90 24.1,69.27 29.08,69.27 arc-90 29.23,69.11 29.23,68.76 29.23,68.63 | 29.23,68.63 arc-90 29.23,68.63 | 29.23,68.63
BOOT  (via drill 0.3)
  Top 0.406: BOOT.2 32.74,44.42 v32.74,45.64
  Bottom 0.406: U6.6 v32.73,45.65 v32.74,45.64
CTL_3.3V
  Top 0.406: U1.23 R8.2
DIO1B
  Top 0.406: R19.2 64.77,53.34 63.73,54.38 U5.15
DIO2B
  Top 0.406: R20.2 63.12,51.13 U5.16
GND  (via drill 0.3)
  Bottom 0.406: D10.2 15.46,23.6 15.21,23.85 14.02,23.85 13.08,22.91
  other vias: 12.54,2.03 4.92,2.21 2.61,4.29 14.53,1.88 32.99,10.79 60.7,10.08 61.31,12.83 59.56,13.34 68.02,7.04 76.42,3.02 75.99,8.03 62.99,4.42 66.59,2.16 77.52,17.65 77.64,15.04 67.53,22.15 12.95,22.68 15.69,27.64 49.25,37.52 49.32,27 53.21,29.51 42.87,34.7 44.67,26.77 38.68,30.25 33.78,29.13 32.18,29.24 30.98,29.06 29.38,24.92 31.14,24.64 32.46,24.79 25.98,25.45 22.55,25.15 18.08,16.87 15.08,15.65 1.98,15.52 6.04,15.52 5.61,27.81 2.99,26.52 6.14,25.07 3.3,36.86 3.68,41.12 1.98,58.95 2.05,55.14 3.09,70.54 5.23,72.06 9.95,68.22 11.27,72.62 18.06,72.82 19.99,64.67 19.68,66.19 23.08,67.23 22.78,62.84 19.43,58.24 22.83,61.32 18.31,56.72 20.82,56.31 22.02,57.05 13.61,36.91 10.38,32.54 13.84,32.87 21.56,35.1 23.16,39.07 21.36,48.34 18.28,48.39 12.39,52.32 11.43,48.41 21.59,46.08 27.17,44.48 26.97,40.06 27.78,32.72 30.73,33.17 28.24,29.01 27.4,26.21 10.33,28.22 13.66,42.93 5.08,47.7 9.52,62.59 4.64,63.78 12.75,62.81 12.52,59.77 12.72,58.04 24.13,72.06 21.26,72.75 24.68,67.77 18.77,68.5 34.24,71.5 33.7,68.22 33.3,63.14 19.38,71.09 26.69,57.35 23.72,56.52 21.13,69.9 39.95,51.46 38.32,47.85 36.09,34.87 38.07,35.53 33.32,31.88 43.07,38.48 42.49,51.28 45.61,43.18 45.67,48.36 50.42,54.76 48,54.76 49.37,59.82 49.15,66.12 48.48,72.03 36.42,72.85 50.11,69.32 50.34,63.5 61.39,71.68 67.13,72.03 66.26,69.01 70.28,67.28 74.98,70.64 77.49,71.81 78.15,68.35 59.79,70.66 61.87,70.15 63.24,68.4 60.35,67.64 59.31,67.77 67.59,60.58 67.31,65.46 74.77,65.23 70.38,61.77 58.7,62.92 50.59,61.65 51.79,59.66 77.29,50.75 74.93,50.6 73.07,51.94 73.68,57.96 72.46,56.67 72.54,32.87 72.46,38.18 68.45,39.22 69.26,37.74 70.61,33.6 71.17,36.58 71.45,40.06 72.74,43.76 66.14,37.11 66.16,39.8 54,46.79 51.86,42.62 53.11,36.93 49.37,35.89 54.02,18.49 55.19,22.38 55.88,26.21 71.27,22.81 76.12,22.76 67.05,19.51 63.22,14.33 30.3,15.29 32.79,15.04 33.63,13.54 34.54,11.84 26.13,7.42 17.85,6.93 14.8,5.64 45.72,7.11 40.38,7.11 33.47,7.16 43.66,17.2 45.18,25.12 45.39,29.51 44.67,28.52 40.2,25.43 72.39,7.77 60.75,22.2 24.81,17.27 21.03,23.27 49.4,42.49 47.44,42.42 38.27,44.81 38.35,41.48 58.59,64.52 52.12,64.41 22.86,65.18
  pour Top (isolate 0.305, rank 6): -4,99 -4,-10 155,-10 155,99
  pour Bottom (isolate 0.305, rank 6): -5,100 -5,-10 155,-10 155,100
GNSS_PWR_CTRL  (via drill 0.3)
  Top 0.406: v25.04,38.1 25.04,30.76 v27.28,28.52
  Bottom 0.406: U6.98 28.27,52.79 27.96,52.48 25.83,52.48 25.04,51.69 v25.04,38.1 | v27.28,28.52 R79.1
GNSS_PWR_EN
  Bottom 0.406: U6.20 25.27,28.24 R79.2
IO0
  Top 0.406: U1.27 55.9,27.58 56.31,27.18 56.87,27.18 | 56.87,27.18 57.2,27.18 | 57.2,27.18 57.73,27.18 | 58.49,27.18 58.9,27.18 | 58.9,27.18 59.2,27.18 | 59.2,27.18 66.32,27.18 P1.5 | R2.1 58.87,26.8 | 58.87,26.85 58.87,27.15 58.9,27.18 | FLASH.2 57.31,27.06 57.2,27.18 | 56.87,27.18 57.3,26.75 57.73,27.18 | 57.73,27.18 58.49,27.18 | 58.49,27.18 58.87,26.8 | 58.87,26.8 58.87,26.85 | 58.87,26.85 59.2,27.18
IO1  (via drill 0.3)
  Top 0.406: U1.39 71.14,30.28 66.67,34.75 v57.96,34.75
  Bottom 0.406: Q11.3 R48.1 40.66,43.1 42.21,41.55 53.36,41.55 57.96,36.96 v57.96,34.75
IO2  (via drill 0.3)
  Top 0.406: U1.38 69.87,30.12 66.09,33.91 v57.13,33.91
  Bottom 0.406: Q12.3 R50.1 41.04,40.74 52.9,40.74 57.13,36.52 v57.13,33.91
IO4  (via drill 0.3)
  Top 0.406: U1.4 68.6,47.68 | 77.85,60.38 U5.5 v74.71,60.38 v74.7,60.38 | v68.37,47.7 68.58,47.7 68.6,47.68 | 68.6,47.68 68.6,47.86 R9.1
  Bottom 0.406: v68.37,47.7 68.37,54.05 v74.7,60.38
IO5  (via drill 0.3)
  Top 0.406: U1.5 v67.33,47.7 | U5.6 v74.7,62.38
  Bottom 0.406: v67.33,47.7 67.33,55.02 v74.7,62.38
IO6
  Top 0.406: U1.6 66.06,50.32 | 66.06,50.32 66.06,53.69 63.37,56.39 U5.14 | R11.1 66.22,50.16 66.06,50.32
IO7
  Top 0.406: U1.7 64.79,48.59 R19.1
IO11/HMOSI  (via drill 0.3)
  Top 0.406: U1.19 57.48,39.32 60.98,42.82 v71.04,42.82 | v75.03,56.36 77.84,56.36 U5.3
  Bottom 0.406: v71.04,42.82 71.04,52.38 v75.03,56.36
IO12/HSCK  (via drill 0.3)
  Top 0.406: U5.4 77.84,58.37 v75.64,58.37 | U1.20 57.38,38.05 61.46,42.14 69.97,42.14 v70.13,41.99
  Bottom 0.406: v70.13,41.99 70.13,52.86 v75.64,58.37
IO13/HMISO  (via drill 0.3)
  Top 0.406: U5.2 v70.28,54.38 | U1.21 57.32,36.78 62,41.45 69.08,41.45 v69.24,41.3
  Bottom 0.406: v69.24,41.3 69.24,53.34 v70.28,54.38
IO15
  Top 0.406: U1.8 63.52,48.21 R20.1
IO19  (via drill 0.3)
  Top 0.406: 3V1.T 57.22,46.21 U1.13 v57.17,42.93 | R40.1 v67.33,15.62
  Bottom 0.406: v67.33,15.62 61.79,21.16 61.79,39.62 58.49,42.93 v57.17,42.93
IO20  (via drill 0.3)
  Top 0.406: 3V2.T 55.93,46.19 U1.14 56.16,45.91 56.16,44.04 v56.21,43.99 | R38.1 v67.41,17.09
  Bottom 0.406: v67.41,17.09 62.48,22.02 62.48,40.16 59.63,43 59.33,43.31 58.65,43.99 v56.21,43.99
IO39  (via drill 0.3)
  Top 0.406: U1.32 62.25,29.92 61.92,30.25 v59.46,30.25
  Bottom 0.406: v59.46,30.25 59.46,37.9 47.57,49.78 R54.1 Q14.3
IO40  (via drill 0.3)
  Top 0.406: v58.59,31.17 62.58,31.17 63.52,30.23 U1.33
  Bottom 0.406: v58.59,31.17 58.77,31.34 58.77,37.41 49.83,46.35 R52.1 Q13.3
IO41  (via drill 0.3)
  Top 0.406: U1.34 64.79,30.32 63.01,32.11 v56.18,32.11
  Bottom 0.406: R41.2 42.11,32.11 v56.18,32.11
IO42  (via drill 0.3)
  Top 0.406: U1.35 66.06,30.38 63.47,32.97 v60.27,32.97 | R35.2 v32.43,52.78
  Bottom 0.406: v60.27,32.97 60.27,38.38 45.87,52.78 v32.43,52.78
LED_WIFI
  Top 0.406: U1.24 52.16,32.97 LED1.A
LORA_ANT
  Top 0.813: U5.9 61.87,66.4 61.87,67.64 arc90 60.35,69.16 LORA.1 LORA_ANT.D
LTE_ANT  (1 unrouted)
  Bottom 0.61: C42.2 R39.1 | U6.60 19.27,56.26 arc-90 20.29,57.28 20.34,57.28 arc90 21.26,58.19 21.26,58.34
LTE_DTR
  Bottom 0.406: U6.3 32.74,48.65 33.04,48.95 33.04,50.06 33.35,50.37 R55.1 35.9,50.37 Q14.2
LTE_RI
  Bottom 0.406: U6.4 34.31,47.65 | 34.31,47.65 35.93,47.65 Q13.2 | R53.1 34.39,47.57 34.31,47.65
LTE_RXD
  Bottom 0.406: U6.10 33.33,41.65 34.21,40.77 R51.1 34.95,40.77 36.28,40.77 Q12.2
LTE_TXD
  Bottom 0.406: U6.9 32.46,42.65 33.73,43.92 R49.1 36.16,43.92 Q11.2
MF_GNSS_RXD
  Bottom 0.406: R56.2 5.53,54.99 7.64,52.88 8.99,52.88 9.85,52.02 9.85,49.53 8.99,48.67 7.29,48.67 U6.49
MF_GNSS_TXD
  Bottom 0.406: U6.50 8.57,49.65 8.99,50.06 8.99,51.51 8.53,51.97 7.36,51.97 4.39,54.94 4.39,58.34 5.08,59.03 R57.2
N$1
  Top 0.406: LED1.C R4.1
N$2
  Bottom 0.406: R23.1 R27.2 7.08,62.12 Q7.1
N$3
  Bottom 0.406: NET.C Q7.3
N$6
  Bottom 0.406: R22.1 NET.A
N$7
  Top 0.61: U9.10 37.01,16.25 32.69,20.57 Q16.4
N$8
  Top 0.61: BOOT.1 22.22,42.52 R43.1
N$9
  Bottom 0.406: R46.1 R47.2 5.01,65.48 Q10.1
N$10
  Top 0.406: R62.2 C37.2 U8.5
N$13
  Top 0.406: Q1.1 C11.2 46.82,50.76 R7.2
N$14
  Top 0.406: R12.2 Q3.1 50.15,34.1 R8.1
N$15
  Top 0.406: U8.1 R60.2
N$16
  Top 0.406: R64.2 U9.6 36.57,12.25 35.43,13.39 35.43,14.4 31.77,18.06 R63.1
N$18
  Top 0.406: R7.1 R6.1 46.55,47.12 Q3.3
N$19  (via drill 0.3)
  Top 0.406: v28.5,36.91 v38.2,36.91
  Bottom 0.406: U6.116 9.69,43.35 10.79,44.45 17.34,44.45 21.13,40.66 21.13,37.9 22.12,36.91 v28.5,36.91 | C58.2 41.94,35.97 D6.- 40.88,36.91 v38.2,36.91
N$20
  Top 0.406: U9.1 30.61,16.25 29.74,17.12 C38.2
N$21
  Top 0.406: DONE.+ CHRG.+ 27.71,17.63 R65.1
N$22
  Bottom 0.406: U6.31 14.28,26.89 R31.1
N$23
  Bottom 0.406: U6.32 13.28,26.77 R32.1
N$24
  Bottom 0.406: U6.33 12.28,27.34 R33.1
N$25
  Top 0.406: U9.3 30.04,14.25 CHRG.-
N$26
  Top 0.406: U4.3 60.88,15.03 60.27,15.65 | 55.94,15.65 L2.1
  Top 0.61: 60.27,15.65 55.91,15.65 | 55.9,15.65 55.91,15.65 | 55.91,15.65 arc90 L2.1
N$27
  Top 0.305: USB-NATIVE.A5 71.16,15.56 R37.2
N$28
  Top 0.305: USB-NATIVE.B5 R34.2
N$29
  Bottom 0.406: R45.1 STA.A
N$30
  Bottom 0.406: Q10.3 7.26,66.22 7.95,66.22 8.33,65.84 STA.C
N$32
  Top 0.305: USB-NATIVE.B6 71.98,17.57 | 71.98,17.57 70.19,17.57 R38.2 | USB-NATIVE.A6 72.15,16.57 71.98,16.74 71.98,17.27 | 71.98,17.27 71.98,17.57 | 71.73,17.53 71.98,17.27 | 71.98,17.27 72.26,17.55
N$33
  Top 0.305: R40.2 70.16,16.07 USB-NATIVE.B7 74.18,16.07 74.39,16.28 74.39,16.71 74.04,17.07 USB-NATIVE.A7
N$34
  Bottom 0.406: Q9.1 39.73,34.22 R42.2 41.45,34.24 R41.1
N$35
  Bottom 0.61: U6.90 29.27,29.32 arc90 31.39,27.2 C45.2
N$36
  Top 0.406: U9.4 29.5,13.25 DONE.-
N$37
  Bottom 0.406: U6.95 7.06,55.86 R56.1
N$38
  Bottom 0.406: U6.96 9.28,55.95 8.23,57 8.23,58.42 7.62,59.03 R57.1
N$39
  Top 0.406: R75.1 C61.1 R74.2 61.53,9.12 U4.7
N$40
  Top 0.406: U4.1 62.19,15.91 R76.1
N$41
  Top 0.406: U9.5 29.59,12.25 R66.2
N$42
  Top 0.406: C49.1 27.73,11.71 R66.1
N$43
  Top 0.406: Q8.1 25.56,51.19 R36.2 R35.1
N$44
  Top 0.406: D4.A 32.7,26.97 Q16.5 Q16.6 Q16.7 Q16.8
  pour Top: 28.55,25.86 36.24,25.86 36.24,28.04 28.55,28.04
N$45
  Top 0.406: D4.C 37.82,22.92 | 37.82,22.92 39.51,22.92 L3.1 | 37.82,22.92 37.88,22.98 D3.C 37.88,28.58 R67.2
  pour Top: 33.98,22.02 38.78,22.02 38.78,27.38 38.38,27.79 38.38,28.96 36.98,28.96 36.98,25.07 36.09,24.18 34.01,24.18 33.98,24.18
N$46
  Top 0.406: R68.1 40.89,17.71 L3.2
  Top 0.61: U9.8 39.34,14.25 R68.1
  pour Top: 39.24,19.79 39.24,14.83 38.86,14.45 38.86,14.07 41.91,14.07 42.64,14.81 42.64,19.76 42.64,19.79
N$47
  Top 0.406: R67.1 C50.1
N$50
  Top 0.406: U4.8 62.19,10.33 R77.1
N$73
  Bottom 0.61: L1.1 C44.1 R44.1
N$76  (via drill 0.3)
  Top 0.61: v41.37,29.9 GPS.D
  Bottom 0.61: C45.1 L1.2 40.05,27.2 arc90 41.37,28.52 v41.37,29.9
NETLED
  Bottom 0.406: R23.2 9.24,57.38 10,56.62 10.92,56.62 11.27,56.26 U6.52
NRST
  Bottom 0.406: U6.16 33.25,35.65 D12.- 35.37,34.05 Q9.3
PWRKEY  (via drill 0.3)
  Top 0.406: Q8.3 30.45,50.24 | 30.45,50.24 C27.2 v30.98,51.36 | PWK.2 30.76,49.94 30.45,50.24
  Bottom 0.406: v30.98,51.36 30.98,50.94 U6.1
RESET  (via drill 0.3)
  Top 0.406: C3.1 63.44,21.98 RST.2 63.6,22.14 R1.1 64.33,25.07 P1.6 | U1.3 69.87,45.16 69.49,44.78 v61.59,44.78
  Bottom 0.406: P1.6 64.31,26.64 64.31,42.06 v61.59,44.78
S3_RXD
  Top 0.406: U1.36 67.33,27.56 68.37,26.52 69.52,26.52 P1.4
S3_TXD
  Top 0.406: U1.37 68.6,27.71 68.96,27.36 71.22,27.36 P1.3
SCL  (via drill 0.3)
  Top 0.406: U1.11 59.71,49.1 57.88,50.93 v57.88,55.42
  Bottom 0.406: R16.1 v57.88,55.42 57.88,55.93 U3.3
SDA  (via drill 0.3)
  Top 0.406: U1.10 60.98,49.33 59.38,50.93 v59.38,55.45
  Bottom 0.406: U3.2 59.38,55.98 v59.38,55.45 59.38,54.55 R17.1
SIM_CLK  (via drill 0.3)
  Top 0.406: SIM.3 17.78,38.53 17.78,27.1 15.36,24.69 | 15.36,24.33 15.36,23.85 | 15.36,23.85 15.36,22.98 v17.04,21.3 | v13.05,24.26 14.96,24.26 | 14.96,24.26 15.29,24.26 15.36,24.33 | 15.36,24.33 15.36,24.69 | 15.36,24.69 14.96,24.28 14.96,24.26 | 14.96,24.26 15.36,23.85
  Bottom 0.406: R32.2 v13.05,24.26 | D10.4 v17.04,21.3 C35.2
SIM_DATA  (via drill 0.3)
  Top 0.406: v16.21,24.18 16.23,24.07 18.89,26.73 18.89,29.95 18.89,30.73 18.89,39.75 18.28,40.36 SIM.7
  Bottom 0.406: R31.2 14.68,25.07 C36.2 16.21,25.06 v16.21,24.18 D10.3
SIM_RST  (via drill 0.3)
  Top 0.406: v8.53,24.99 8.53,37.29 12.87,41.63 17.22,41.63 SIM.2
  Bottom 0.406: v8.53,24.99 C34.2 R33.2 11.45,21.92 13.28,20.09 15.24,20.09 15.46,20.32 D10.5
SIM_VDD  (via drill 0.3)  (1 unrouted)
  Top 0.406: SIM.1 17.99,44.16 19.76,42.39 19.76,25.65 v17.9,23.8
  Bottom 0.406: U6.30 15.28,29.4 17.85,26.82 | C21.2 C52.2 v17.9,23.8 17.9,23.09 17.01,22.2 14.98,22.2 14.71,21.93 D10.6
STATUS  (via drill 0.3)
  Top 0.406: v25.27,58.57 21.15,58.57 18.39,61.34 v3.3,61.34
  Bottom 0.406: R46.2 v3.3,61.34 | U6.66 v25.27,58.57
UART_LOG_RX
  Bottom 0.406: U6.22 23.27,29.1 23.85,28.52 RX.T
UART_LOG_TX
  Bottom 0.406: U6.23 TX.T
V4D2
  Top 0.406: R59.1 C41.2 C60.2 56.08,9.04 | 56.08,9.04 C8.2 C61.2 R75.2 | U4.5 56.07,11.5 L2.2 | L2.2 55.93,9.2 56.08,9.04 | Q15.1 51.11,11.67 | 51.11,11.67 51.42,11.36 L2.2 | D11.A 51.42,11.98 51.11,11.67
  pour Top: 49.53,16.81 49.53,12.78 51.81,10.49 51.81,8.61 57.55,8.61 58.01,8.15 58.01,7.11 59.03,7.11 59.03,9.45 60.32,10.74 60.32,12.5 53.08,12.5 52.32,13.26 52.32,16.74 52.32,16.81
V5D0  (via drill 0.3)  (2 unrouted)
  Top 0.406: U4.2 61.53,16.64 | 61.53,16.64 61.53,18.24 D1.A | R76.2 61.46,16.56 61.53,16.64 | R77.2 64.49,9.54 D5.C 64.49,14.33 C62.2 C63.2 C64.2 63.34,18.92 D1.A | v60.96,18.92 D1.A
  Top 1.016: v44.29,30.96 44.29,51.59 42.69,53.19 40.2,53.19 36.52,56.87 36.52,57.91 36.45,57.99 36.45,63.42 37.36,64.34 40.89,64.34 | 40.89,66.47 40.89,69.77 39.59,71.07 39.62,71.07 J4.1 | CN1.PWR1 37.54,58 | 37.54,58 38.11,58 38.55,58.45 | 37.59,57.95 37.54,58 | 40.89,64.31 40.89,64.34 | 40.89,64.34 40.89,65.38 | 40.89,65.38 40.92,65.41 | 40.89,65.38 40.89,66.47 | 40.89,66.47 40.93,66.43 J2.+
  Bottom 1.016: v60.96,18.92 48.92,30.96 v44.29,30.96
  pour Top: 65.22,8.81 65.22,18.11 63.22,20.12 60.6,20.12 60.6,16.54 61.41,15.72 61.62,15.72 61.62,17.07 62.07,17.53 63.67,17.53 64.08,17.12 64.08,8.81
V_BATT  (via drill 0.3)
  Top 0.61: v4.67,53.03 8.18,56.54 v15.26,56.54
  Bottom 0.254: R22.2 R45.2 14.22,67.28 R78.1 R58.1 | C23.2 R58.1 | R58.1 C19.2
  Bottom 0.406: U6.55 U6.56 U6.57 16.27,56.52 16.27,57.72 D7.- 16.33,57.9 16.33,58.75 | 16.33,58.75 C47.2 C46.2 16.33,61.52 | 16.33,61.52 C24.2 16.33,63.96 | 16.33,63.96 C20.2 C22.2 C23.2 | D8.C 16.14,63.96 16.33,63.96 | C48.A 14.52,61.52 16.33,61.52 | C26.A 16.33,58.75
  Bottom 0.61: R28.2 v4.67,53.03 | v15.26,56.54 16.25,56.54 16.27,56.52
  pour Bottom: 16.61,53.59 16.61,69.77 15.11,71.27 14.07,71.27 14.07,66.78 13.69,66.4 13.69,57.38 13.99,57.07 13.99,53.59
VBAT+
  Top 0.254: J3.+ C57.1 C54.1 C6.1 25.34,9.78 R62.1
  Top 0.406: R68.2 40.52,9.08 | 40.52,9.08 40.08,8.64 28.01,8.64 R62.1 | 40.52,9.08 40.55,9.05 D2.A C51.1 C53.1 | C53.1 Q15.3 | C53.1 C29.1
  Top 0.61: U9.7 38.79,13.25 40.92,11.12 40.92,9.47 R68.2
  pour Top: 1.98,10.49 20.16,10.49 20.77,11.1 26.54,11.1 28.24,9.4 38.4,9.4 39.34,10.34 39.37,10.36 39.37,11.25 39.37,12.42 41.55,12.42 42.87,11.1 50.24,11.1 51.1,10.24 51.1,8.64 46.86,8.64 46.27,8.05 27.48,8.05 26.29,9.25 2.13,9.25 1.98,9.25
VBAT-
  Top 0.254: J3.- 19.39,11.77 R61.2 22.07,12.78 U8.3 23.05,12.79 23.29,13.03 23.29,14.33 23.64,14.68 24.48,14.68 U8.6 25.06,15.27 C37.1
  pour Top: 1.98,11.1 19.73,11.1 20.52,11.89 22.78,11.89 23.59,12.7 23.59,14.2 23.77,14.38 23.82,14.43 25.12,14.43 25.6,14.91 26.49,14.91 26.51,14.94 26.51,15.7 23.72,15.7 22.93,14.91 22.93,13.23 22.78,13.08 19.63,13.08 18.84,12.29 2.18,12.29 1.98,12.29
VBAT_ADC
  Bottom 0.61: U6.51 R29.2 C10.1 R28.1
VBUS  (via drill 0.3)
  Top 0.406: R63.2 C38.1 R65.2 28.05,19.5 23.87,19.5 | R63.2 31.42,19.63 Q16.3 Q16.2 Q16.1 | J1.+ 23.87,19.5 | 23.87,19.5 23.82,19.55 C39.1 C40.1 C56.1 | U9.9 36.46,15.25 32.13,19.58 R63.2
  Top 1.016: D1.C v56.44,18.92 | v27.96,20.8 27.96,19.76 R65.2
  Bottom 1.016: v27.96,20.8 54.55,20.8 v56.44,18.92
  pour Top: 1.98,20.35 21.48,20.35 23.26,22.12 31.59,22.12 31.59,20.4 36.45,15.54 37.87,15.54 37.87,15.11 35.78,15.11 31.9,19 2.18,19 1.98,19
VBUSB
  Bottom 0.406: U6.24 21.27,29.1 20.75,28.57 VU.T
VCC  (via drill 0.3)
  Top 0.813: R9.2 67.89,50.16 R11.2 67.87,53.8 63.28,58.38 U5.13 61.84,58.41 C15.1 C14.1 v55.6,58.41 52.07,54.88 Q1.3
  Bottom 0.406: 55.6,59.05 C7.2 55.83,59.08
  Bottom 0.813: 55.6,59.05 v55.6,58.41 | U3.4 55.83,59.08
VDD_AUX  (1 unrouted)
  Bottom 0.61: U6.99 29.27,57.55 C30.2 29.28,58.37 | 29.28,58.37 C31.2 | 3V.T 29.28,58.37 | 28.04,58.37 28.42,58.37 29.31,57.48 29.31,59.18 29,59.18 28.42,58.6
VIN_I
  Top 0.406: Q15.2 48.12,14.78 D11.C 45.28,15.52 | 45.28,16.05 45.28,15.52 | 45.28,15.52 45.28,13.38 D2.C | C28.2 45.31,16.08 45.28,16.05 | 45.28,16.05 S1.1
  pour Top: 43.73,12.06 48.56,12.06 48.56,16.84 46.43,18.97 46.43,19.86 44.27,19.86 44.27,17.98 44.95,17.3 44.95,15.42 43.91,14.38 43.73,14.2
VIN_O  (via drill 0.3)
  Top 0.254: 22.04,59.66 21.66,59.66 21.66,59.69 | 22.04,59.66 22.04,59.69 22.14,59.69 22.14,59.66 22.04,59.66
  Top 0.406: U2.3 R25.2 49.3,39.28 | U2.1 48.27,39.37 C4.1 49.3,39.28 | v49.3,39.73 49.3,39.28
  Top 0.813: v56.23,35.79 v68,35.79 | v42.95,39.73 42.95,48.06 arc90 41.22,49.78 39.98,49.78 arc-90 38.25,51.51 30.07,59.69 22.04,59.69 21.66,59.69 v12.98,68.38 | S1.2 46.43,21.36 46.94,21.87 v46.94,32.95
  Bottom 0.813: v56.23,35.79 52.3,39.73 v49.3,39.73 47.29,39.73 | v42.95,39.73 45.59,39.73 | 45.59,39.73 46.4,39.73 | 46.4,39.73 47.29,39.73 | v68,35.79 68,30.04 71.12,26.92 76.73,26.92 P1.1 | 46.45,38.86 v46.45,33.6 46.43,33.6 46.94,33.1 v46.94,32.95 | 46.45,38.89 46.45,39.67 46.4,39.73 | R78.2 v12.98,68.38 R58.2 | 45.59,39.73 46.45,38.86 | 46.45,38.86 46.45,38.89 | 46.45,38.89 47.29,39.73
  pour Top: 45.97,33.78 45.97,33.3 46.55,32.72 46.55,22.2 46.2,21.84 44.29,21.84 44.29,20.9 46.81,20.9 47.37,21.46 47.37,33.38 46.71,34.04 46.22,34.04
  pour Top: 47.9,41.83 47.9,38.73 50.67,38.73 50.67,41.81 49.93,41.81 49.93,40.39 49.65,40.11 48.76,40.11 48.54,40.34 48.54,41.83
VUSB  (via drill 0.3)
  Top 0.254: 71.59,19.27 71.59,19.34 v71.57,19.36
  Top 0.61: USB-NATIVE.VBUS1 72.09,14.37 v71.59,13.86 70.89,13.16 70.48,12.75 | 70.48,12.75 C17.1 | USB-NATIVE.VBUS2 71.59,19.27 71.11,19.27 70.28,20.09 C18.1 | 68.42,12.55 70.28,12.55 70.48,12.75 | 70.48,12.75 69.75,12.01 69.29,12.01
  Top 0.813: D5.A C17.1
  Bottom 0.61: v71.57,19.36 71.57,13.87 v71.59,13.86
WIFI_RST  (via drill 0.3)
  Top 0.406: WIFI.2 57.36,22.82 R3.1 v58.87,24.94 | v58.29,41.78 58.29,46.01 U1.12
  Bottom 0.406: v58.29,41.78 61.11,38.96 61.11,27.18 v58.87,24.94

### Text on the board
tPlace: SMA1 | LORA | + | - | - | + | + | - | SenseLora 4G | LTE CAT1 Gateway V1.2 | www.makerfabs.com | DC5V | SOLAR | OFF | RST | RXD | IO0 | GND | TXD | VCC | - | ON | + | BAT | - | +
bPlace: + | - | RFM98W 915MHz | RFM98W 868MHz | RFM98W 433MHz | GND | VCC